# Altium project 2015_FDP.PrjPcb (part 1 of 2)
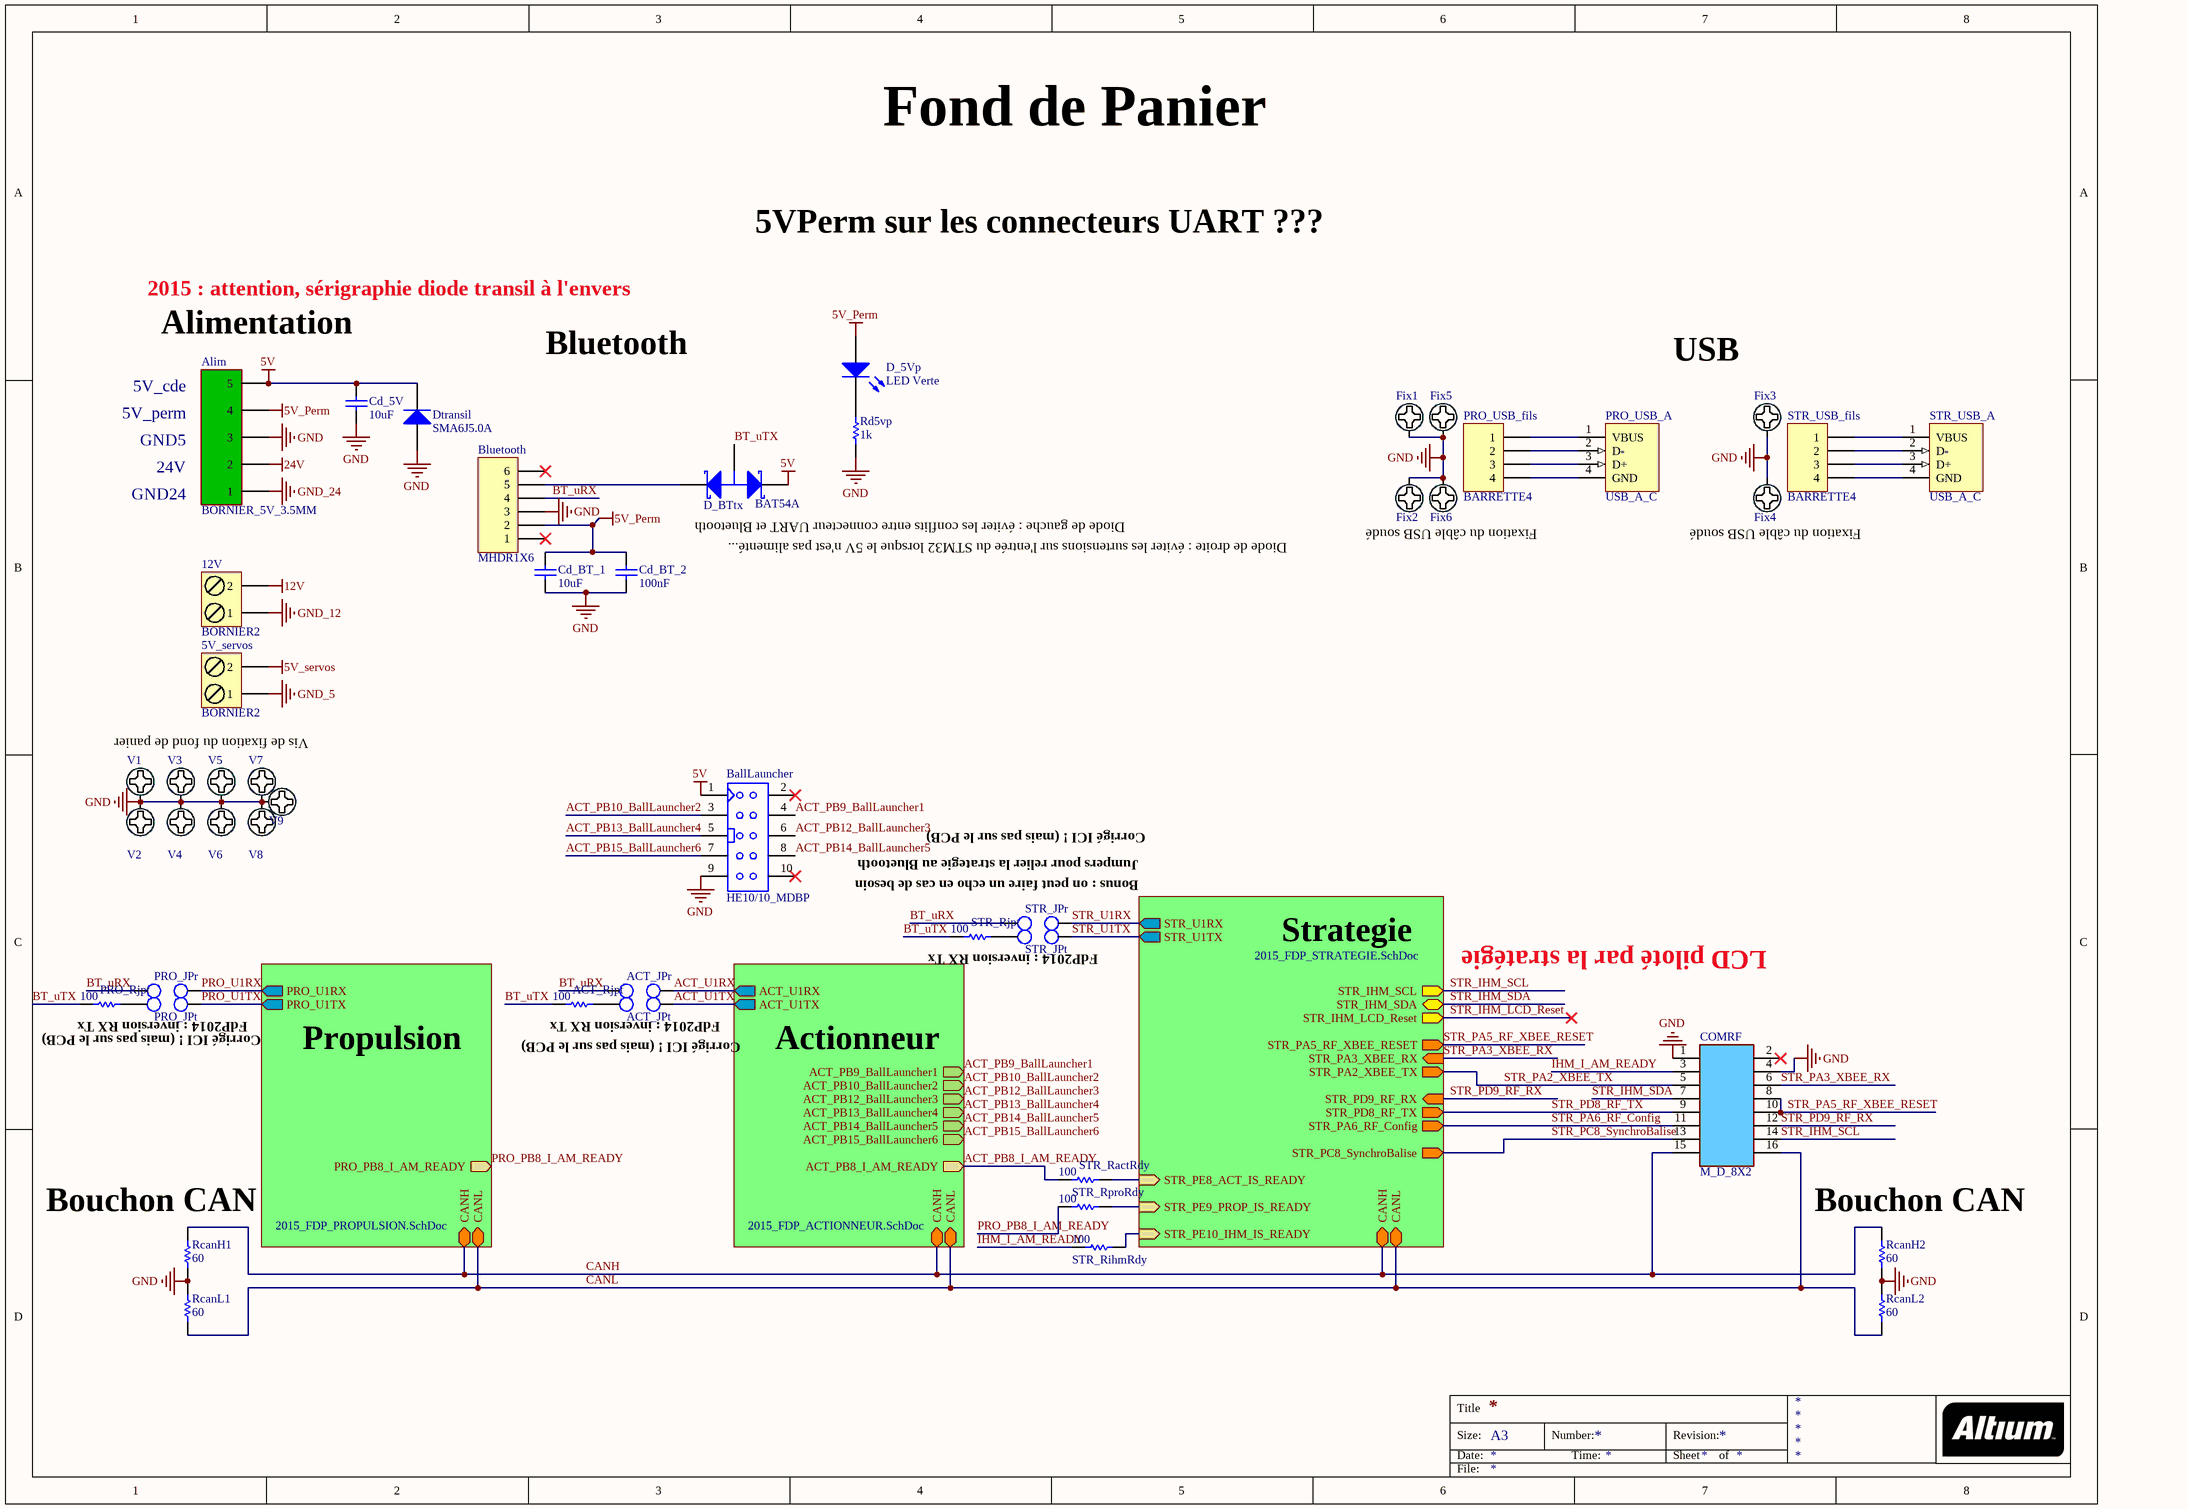
[diagram p0: 2015_FDP_SCHEMA.SchDoc]
4 sheets, 288 parts. Net scope: hierarchical (ports join the sheet entries above them; power ports are global).
Board file: 2015_FDP_PCB.PcbDoc
Sheets:
  2015_FDP_SCHEMA.SchDoc
    Propulsion = 2015_FDP_PROPULSION.SchDoc
    Strategie = 2015_FDP_STRATEGIE.SchDoc
    Actionneur = 2015_FDP_ACTIONNEUR.SchDoc

## Sheet 2015_FDP_SCHEMA.SchDoc
size A3

### Parts
5V_servos  BORNIER2  [BORNIER_2V_5.08MM]
12V  BORNIER2  [BORNIER_2V_5.08MM]
ACT_JPr  JUMPER2  [BARRETTE_2_M_D]  (value not drawn)
ACT_JPt  JUMPER2  [BARRETTE_2_M_D]  (value not drawn)
ACT_Rjpt  100  [R1206_N]
Alim  BORNIER_5V_3.5MM  [BORNIER_5V_3.5MM_femelle_0]
BallLauncher  Type: HE10/10_MDBP  [HE10/10_M_D_BP]  (hidden comment: HE10/10_MALE_DROIT_BAS_PROFIL)
Bluetooth  MHDR1X6  [HE14_6]
Cd_5V  10uF  [C1206_N]
Cd_BT_1  10uF  [C1206_N]
Cd_BT_2  100nF  [C0805_N]
COMRF  Type: M_D_8X2  [HE10/16_M_D_B P]  (hidden comment: BARRETTE_8 CONTACTS_2 RANGEES_MALE_DROITE)
D_5Vp  LED Verte  [LED_0805]
D_BTtx  BAT54A  [SOT23-3N]
Dtransil  SMA6J5.0A  [DO214AC]
Fix1  Pad_M3  [Point Test_D3_P1.6mm]  (value not drawn)
Fix2  Pad_M3  [Point Test_D3_P1.6mm]  (value not drawn)
Fix3  Pad_M3  [Point Test_D3_P1.6mm]  (value not drawn)
Fix4  Pad_M3  [Point Test_D3_P1.6mm]  (value not drawn)
Fix5  Pad_M3  [Point Test_D3_P1.6mm]  (value not drawn)
Fix6  Pad_M3  [Point Test_D3_P1.6mm]  (value not drawn)
PRO_JPr  JUMPER2  [BARRETTE_2_M_D]  (value not drawn)
PRO_JPt  JUMPER2  [BARRETTE_2_M_D]  (value not drawn)
PRO_Rjpt  100  [R1206_N]
PRO_USB_A  USB_A_COUDEE  [USB_A_C]  (value not drawn)
PRO_USB_fils  BARRETTE4  [HE14_4]
RcanH1  60  [R1206_N]
RcanH2  60  [R1206_N]
RcanL1  60  [R1206_N]
RcanL2  60  [R1206_N]
Rd5vp  1k  [R1206_N]
STR_JPr  JUMPER2  [BARRETTE_2_M_D]  (value not drawn)
STR_JPt  JUMPER2  [BARRETTE_2_M_D]  (value not drawn)
STR_RactRdy  100  [R1206_N]
STR_RihmRdy  100  [R1206_N]
STR_Rjpt  100  [R1206_N]
STR_RproRdy  100  [R1206_N]
STR_USB_A  USB_A_COUDEE  [USB_A_C]  (value not drawn)
STR_USB_fils  BARRETTE4  [HE14_4]
V1  Pad_M3  [M3x6mm Torx]  (value not drawn)
V2  Pad_M3  [M3x6mm Torx]  (value not drawn)
V3  Pad_M3  [M3x6mm Torx]  (value not drawn)
V4  Pad_M3  [M3x6mm Torx]  (value not drawn)
V5  Pad_M3  [M3x6mm Torx]  (value not drawn)
V6  Pad_M3  [M3x6mm Torx]  (value not drawn)
V7  Pad_M3  [M3x6mm Torx]  (value not drawn)
V8  Pad_M3  [M3x6mm Torx]  (value not drawn)
V9  Pad_M3  [M3x6mm Torx]  (value not drawn)

### Sub-sheets
Actionneur = 2015_FDP_ACTIONNEUR.SchDoc: CANH (bidir), CANL (bidir), ACT_PB9_BallLauncher1 (out), ACT_PB10_BallLauncher2 (out), ACT_PB12_BallLauncher3 (out), ACT_PB13_BallLauncher4 (out), ACT_PB14_BallLauncher5 (out), ACT_PB15_BallLauncher6 (out), ACT_U1RX (out), ACT_U1TX (out), ACT_PB8_I_AM_READY (out)
Propulsion = 2015_FDP_PROPULSION.SchDoc: CANH (bidir), CANL (bidir), PRO_U1RX (out), PRO_U1TX (out), PRO_PB8_I_AM_READY (out)
Strategie = 2015_FDP_STRATEGIE.SchDoc: STR_IHM_SCL (out), STR_IHM_SDA (bidir), STR_IHM_LCD_Reset (out), STR_PA3_XBEE_RX (in), STR_PA2_XBEE_TX (out), STR_PA5_RF_XBEE_RESET (out), STR_PA6_RF_Config (out), STR_PC8_SynchroBalise (out), STR_PD8_RF_TX (out), STR_PD9_RF_RX (in), CANL (bidir), CANH (bidir), STR_U1RX (out), STR_U1TX (out), STR_PE9_PROP_IS_READY (in), STR_PE8_ACT_IS_READY (in), STR_PE10_IHM_IS_READY (in)

### Nets
5V: Alim.5 BallLauncher.1 Cd_5V.2 D_BTtx.2(K2) Dtransil.2(K)
5V_Perm: Alim.4 Bluetooth.2 Cd_BT_1.2 Cd_BT_2.2 D_5Vp.1(A)
5V_servos: 5V_servos.2
12V: 12V.2
24V: Alim.2
GND: Alim.3 BallLauncher.9 Bluetooth.3 Cd_5V.1 Cd_BT_1.1 Cd_BT_2.1 COMRF.1 COMRF.4 Dtransil.1(A) Fix1.1 Fix2.1 Fix3.1 Fix4.1 Fix5.1 Fix6.1 RcanH1.1 RcanH2.2 RcanL1.2 RcanL2.2 Rd5vp.2 V1.1 V2.1 V3.1 V4.1 V5.1 V6.1 V7.1 V8.1 V9.1
GND_5: 5V_servos.1
GND_12: 12V.1
GND_24: Alim.1
ACT_PB8_I_AM_READY: STR_RactRdy.2 ; sheet Actionneur/ACT_PB8_I_AM_READY
ACT_PB9_BallLauncher1: BallLauncher.4 ; sheet Actionneur/ACT_PB9_BallLauncher1
ACT_PB10_BallLauncher2: BallLauncher.3 ; sheet Actionneur/ACT_PB10_BallLauncher2
ACT_PB12_BallLauncher3: BallLauncher.6 ; sheet Actionneur/ACT_PB12_BallLauncher3
ACT_PB13_BallLauncher4: BallLauncher.5 ; sheet Actionneur/ACT_PB13_BallLauncher4
ACT_PB14_BallLauncher5: BallLauncher.8 ; sheet Actionneur/ACT_PB14_BallLauncher5
ACT_PB15_BallLauncher6: BallLauncher.7 ; sheet Actionneur/ACT_PB15_BallLauncher6
ACT_U1RX: ACT_JPr.2 ; sheet Actionneur/ACT_U1RX
ACT_U1TX: ACT_JPt.2 ; sheet Actionneur/ACT_U1TX
BT_uRX: ACT_JPr.1 Bluetooth.4 PRO_JPr.1 STR_JPr.1
BT_uTX: ACT_Rjpt.2 D_BTtx.3(A) PRO_Rjpt.2 STR_Rjpt.2
CANH: COMRF.15 RcanH1.2 RcanH2.1 ; sheet Propulsion/CANH, sheet Strategie/CANH, sheet Actionneur/CANH
CANL: COMRF.16 RcanL1.1 RcanL2.1 ; sheet Propulsion/CANL, sheet Strategie/CANL, sheet Actionneur/CANL
IHM_I_AM_READY: COMRF.3 STR_RihmRdy.2
PRO_PB8_I_AM_READY: STR_RproRdy.2 ; sheet Propulsion/PRO_PB8_I_AM_READY
PRO_U1RX: PRO_JPr.2 ; sheet Propulsion/PRO_U1RX
PRO_U1TX: PRO_JPt.2 ; sheet Propulsion/PRO_U1TX
STR_IHM_SCL: COMRF.14 ; sheet Strategie/STR_IHM_SCL
STR_IHM_SDA: COMRF.7 ; sheet Strategie/STR_IHM_SDA
STR_PA2_XBEE_TX: COMRF.5 ; sheet Strategie/STR_PA2_XBEE_TX
STR_PA3_XBEE_RX: COMRF.6 ; sheet Strategie/STR_PA3_XBEE_RX
STR_PA5_RF_XBEE_RESET: COMRF.8 COMRF.10 ; sheet Strategie/STR_PA5_RF_XBEE_RESET
STR_PA6_RF_Config: COMRF.11 ; sheet Strategie/STR_PA6_RF_Config
STR_PC8_SynchroBalise: COMRF.13 ; sheet Strategie/STR_PC8_SynchroBalise
STR_PD8_RF_TX: COMRF.9 ; sheet Strategie/STR_PD8_RF_TX
STR_PD9_RF_RX: COMRF.12 ; sheet Strategie/STR_PD9_RF_RX
STR_PE8_ACT_IS_READY: STR_RactRdy.1 ; sheet Strategie/STR_PE8_ACT_IS_READY
STR_PE9_PROP_IS_READY: STR_RproRdy.1 ; sheet Strategie/STR_PE9_PROP_IS_READY
STR_PE10_PROP_IS_READY: STR_RihmRdy.1 ; sheet Strategie/STR_PE10_IHM_IS_READY
STR_U1RX: STR_JPr.2 ; sheet Strategie/STR_U1RX
STR_U1TX: STR_JPt.2 ; sheet Strategie/STR_U1TX
NetACT_JPt_1: ACT_JPt.1 ACT_Rjpt.1
NetBluetooth_5: Bluetooth.5 D_BTtx.1(K1)
NetD_5Vp_2: D_5Vp.2(K) Rd5vp.1
NetPRO_JPt_1: PRO_JPt.1 PRO_Rjpt.1
NetPRO_USB_A_1: PRO_USB_A.1(VBUS) PRO_USB_fils.1
NetPRO_USB_A_2: PRO_USB_A.2(D-) PRO_USB_fils.2
NetPRO_USB_A_3: PRO_USB_A.3(D+) PRO_USB_fils.3
NetPRO_USB_A_4: PRO_USB_A.4(GND) PRO_USB_fils.4
NetSTR_JPt_1: STR_JPt.1 STR_Rjpt.1
NetSTR_USB_A_1: STR_USB_A.1(VBUS) STR_USB_fils.1
NetSTR_USB_A_2: STR_USB_A.2(D-) STR_USB_fils.2
NetSTR_USB_A_3: STR_USB_A.3(D+) STR_USB_fils.3
NetSTR_USB_A_4: STR_USB_A.4(GND) STR_USB_fils.4

Not connected (* = marked no-connect by the designer): BallLauncher 2* 10*; Bluetooth 1* 6*; COMRF 2*

### Notes on the sheet
- Fond de Panier
- 5VPerm sur les connecteurs UART ???
- 2015 : attention, sérigraphie diode transil à l'envers
- Alimentation
- Bluetooth
- USB
- 5V_perm
- 5V_cde
- GND5
- 24V
- GND24
- Diode de gauche : éviter les conflits entre connecteur UART et Bluetooth
- (near Cd_BT_2) Diode de droite : éviter les surtensions sur l'entrée du STM32 lorsque le 5V n'est pas alimenté...
- Fixation du câble USB soudé
- Vis de fixation du fond de panier
- Jumpers pour relier la strategie au Bluetooth
- Corrigé ICI ! (mais pas sur le PCB)
- Bonus : on peut faire un echo en cas de besoin
- FdP2014 : inversion RX Tx
- LCD piloté par la stratégie
- (near RcanH1) Bouchon CAN
- (near RcanH2) Bouchon CAN
- Title
- Size:
- Date:
- A3
- Number:
- Time:
- Revision:
- Sheet
- of
- File:

### Library data of the parts
5V_servos 12V = BORNIER2: Terminal blocks, 2 pins, pitch=5mm
ACT_JPr ACT_JPt PRO_JPr PRO_JPt STR_JPr STR_JPt = JUMPER2: BARRETTE 2 CONTACTS 1 RANGEE MALE DROITE; Type: JUMPER2
ACT_Rjpt PRO_Rjpt RcanH1 RcanH2 RcanL1 RcanL2 Rd5vp STR_RactRdy STR_RihmRdy STR_Rjpt STR_RproRdy = Resistor: Published: 8-Jun-2000; LatestRevisionDate: 17-Jul-2002; LatestRevisionNote: Re-released for DXP Platform.; PackageReference: AXIAL-0.5; Publisher: Altium Limited
BallLauncher = HE10/10_MALE_DROIT_BAS_PROFIL: EMBASE HE10/10 MALE DROIT BAS PROFIL
Bluetooth = MHDR1X6: Header, 6-Pin; LatestRevisionDate: 17-Jul-2002; LatestRevisionNote: Re-released for DXP Platform.; Publisher: Altium Limited
Cd_5V Cd_BT_1 Cd_BT_2 = Condensateur: Capacitor; Published: 8-Jun-2000; LatestRevisionDate: 17-Jul-2002; LatestRevisionNote: Re-released for DXP Platform.; PackageReference: RAD-0.3; Publisher: Altium Limited
D_5Vp = LED: Typical LED; Published: 8-Jun-2000; LatestRevisionDate: 08-Jul-2005; LatestRevisionNote: Mech Layer 1 removed.; PackageReference: LED-1; Publisher: Altium Limited
D_BTtx = Diode Shottky double  BAT54A: DIODE SCHOTTKY DOUBLE; Manufacturer: ZETEX; ComponentLink1URL: http://www.farnell.com/datasheets/27632.pdf; ComponentLink1Description: http://www.farnell.com/datasheets/27632.pdf; Supplier Part Number: 9526498; Supplier: Farnell; RoHS: YES; Manufacturer Part Number: BAT54A
Dtransil = Diode 1N4001: 1 Amp General Purpose Rectifier; Published: 8-Jun-2000; LatestRevisionDate: 17-Jul-2002; LatestRevisionNote: Re-released for DXP Platform.; DatasheetVersion: 1998; PackageVersion: Aug-1999; PackageReference: DO-41; Publisher: Altium Limited; Code_JEDEC: DO-204-AL; ComponentLink1Description: Manufacturer Link; ComponentLink1URL: http://www.fairchildsemi.com/; ComponentLink2Description: Datasheet; ComponentLink2URL: http://www.fairchildsemi.com/ds/1N%2F1N4001.pdf
Fix1-Fix6 V1-V9 = Vis M3 X 6mm _TORX_Tête 6mm: Publisher: Damien Guitton
PRO_USB_A STR_USB_A = USB_A_COUDEE: EMBASE USB TRAVERSANTE TYPE A COUDEE; Type: USB_A_C
PRO_USB_fils STR_USB_fils = BARRETTE4: Header, 4-Pin; LatestRevisionDate: 17-Jul-2002; LatestRevisionNote: Re-released for DXP Platform.; Publisher: Altium Limited

## Sheet 2015_FDP_PROPULSION.SchDoc
size A2
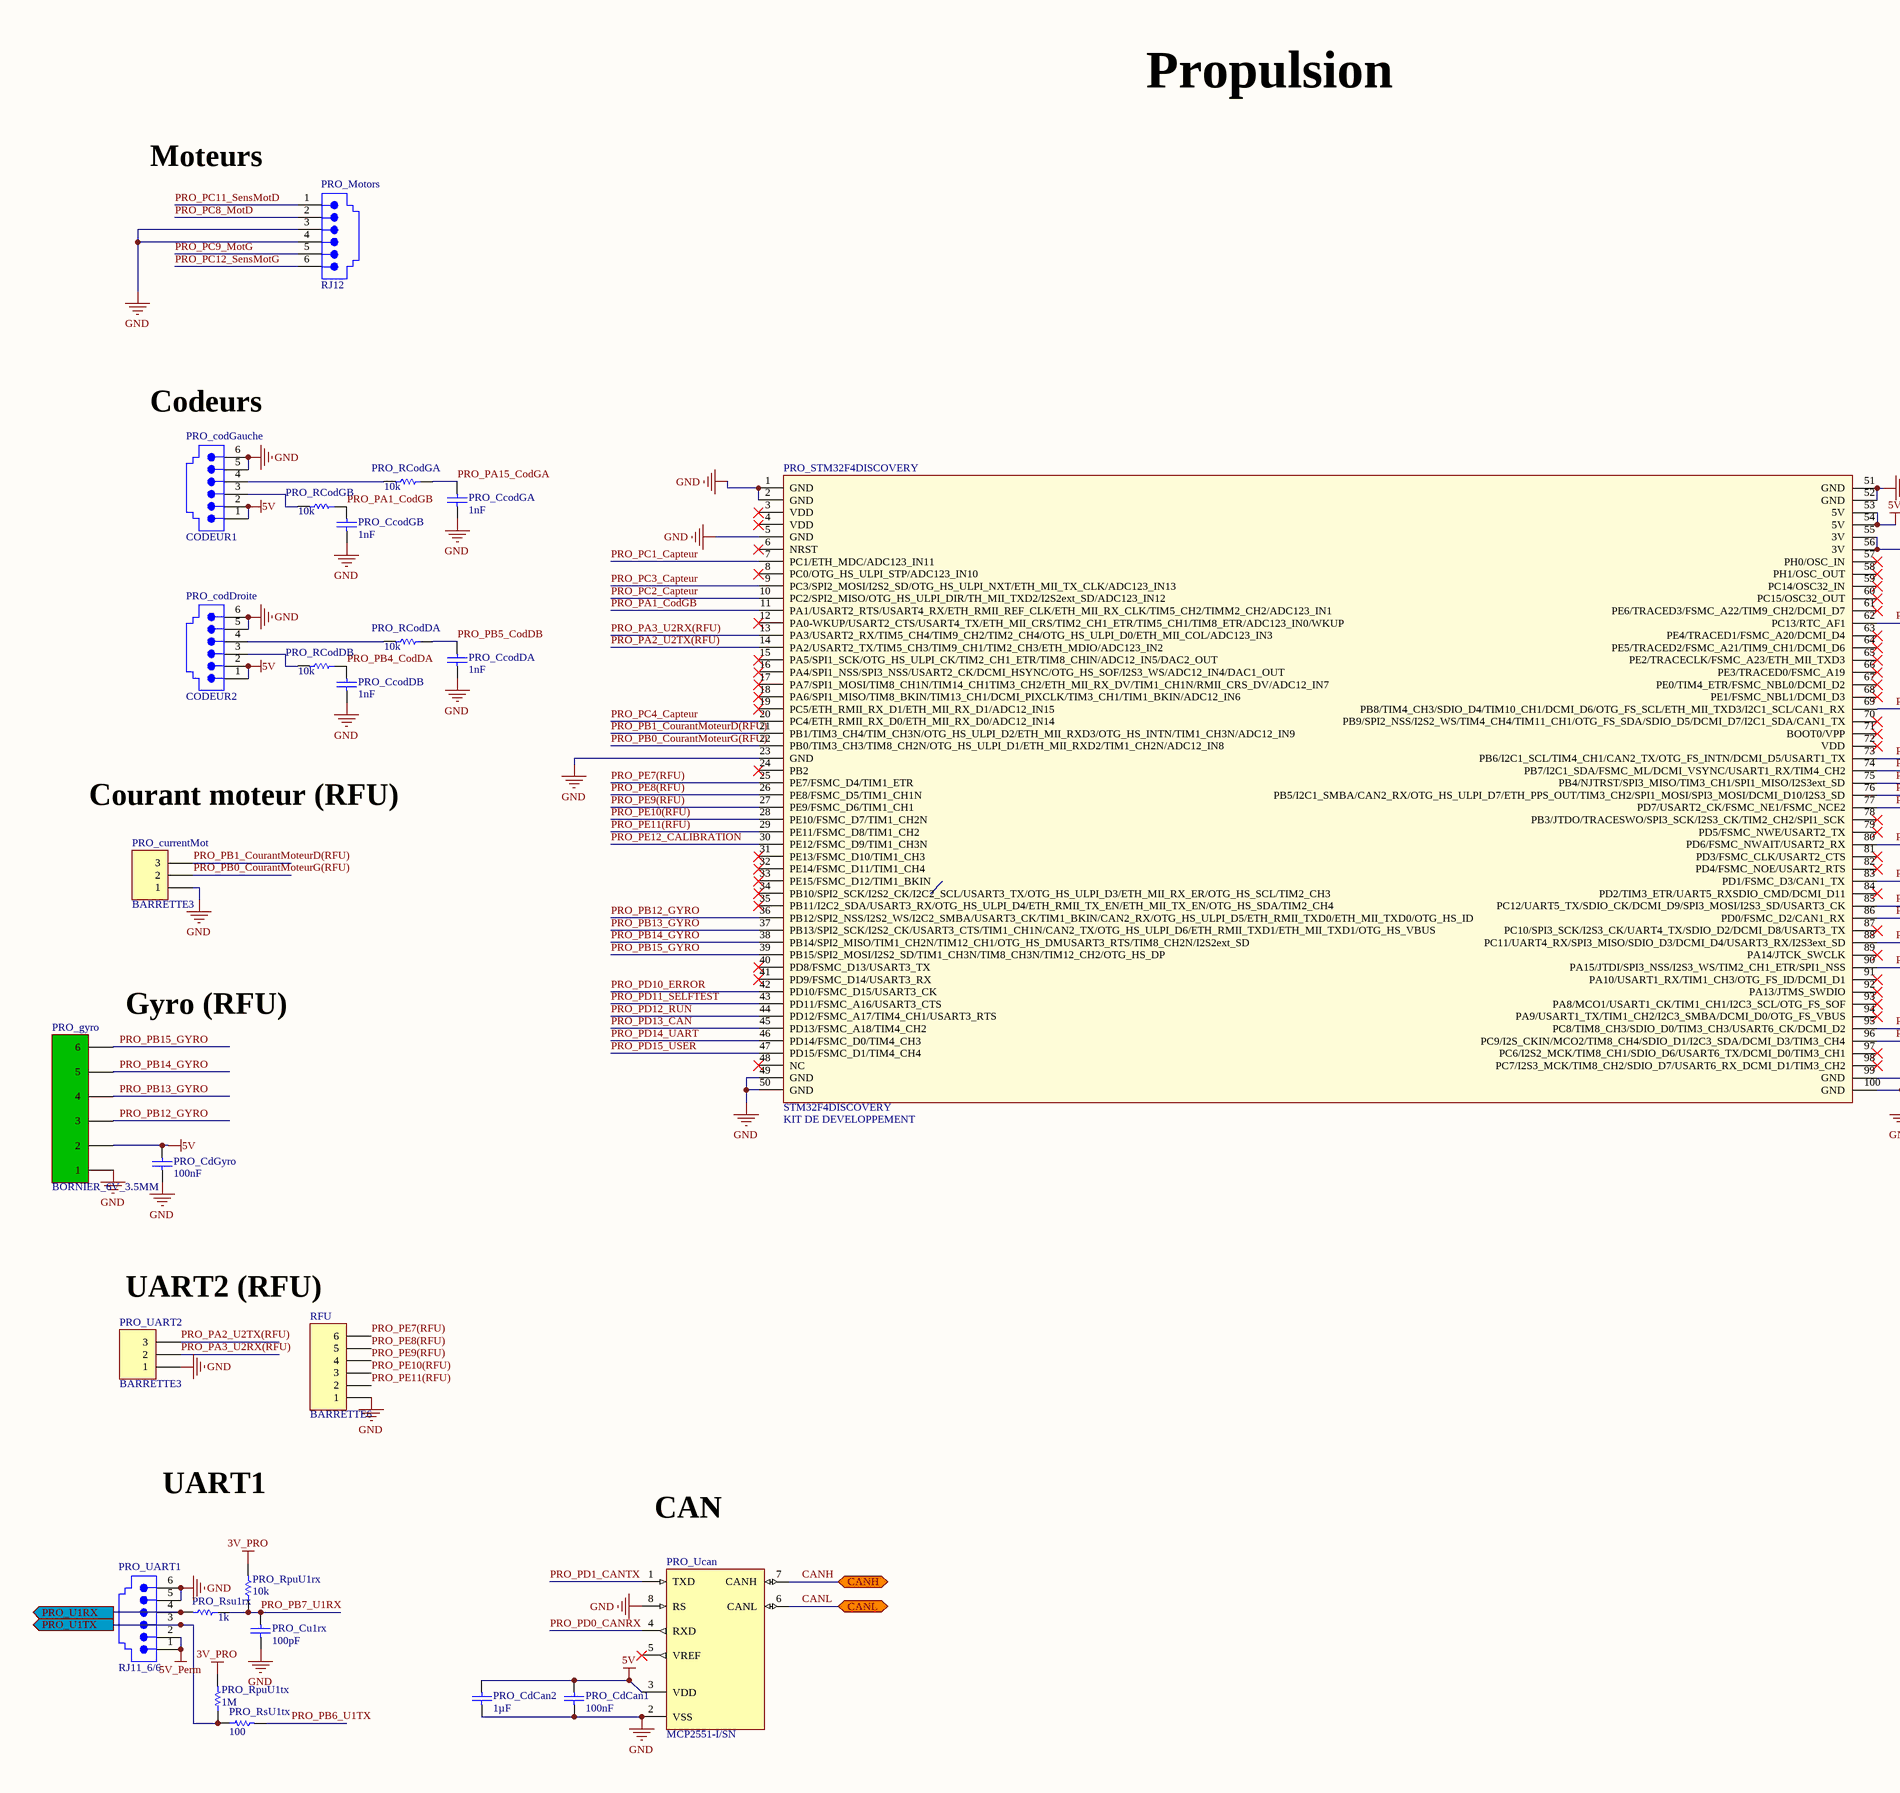
[diagram p1: 2015_FDP_PROPULSION.SchDoc, left]
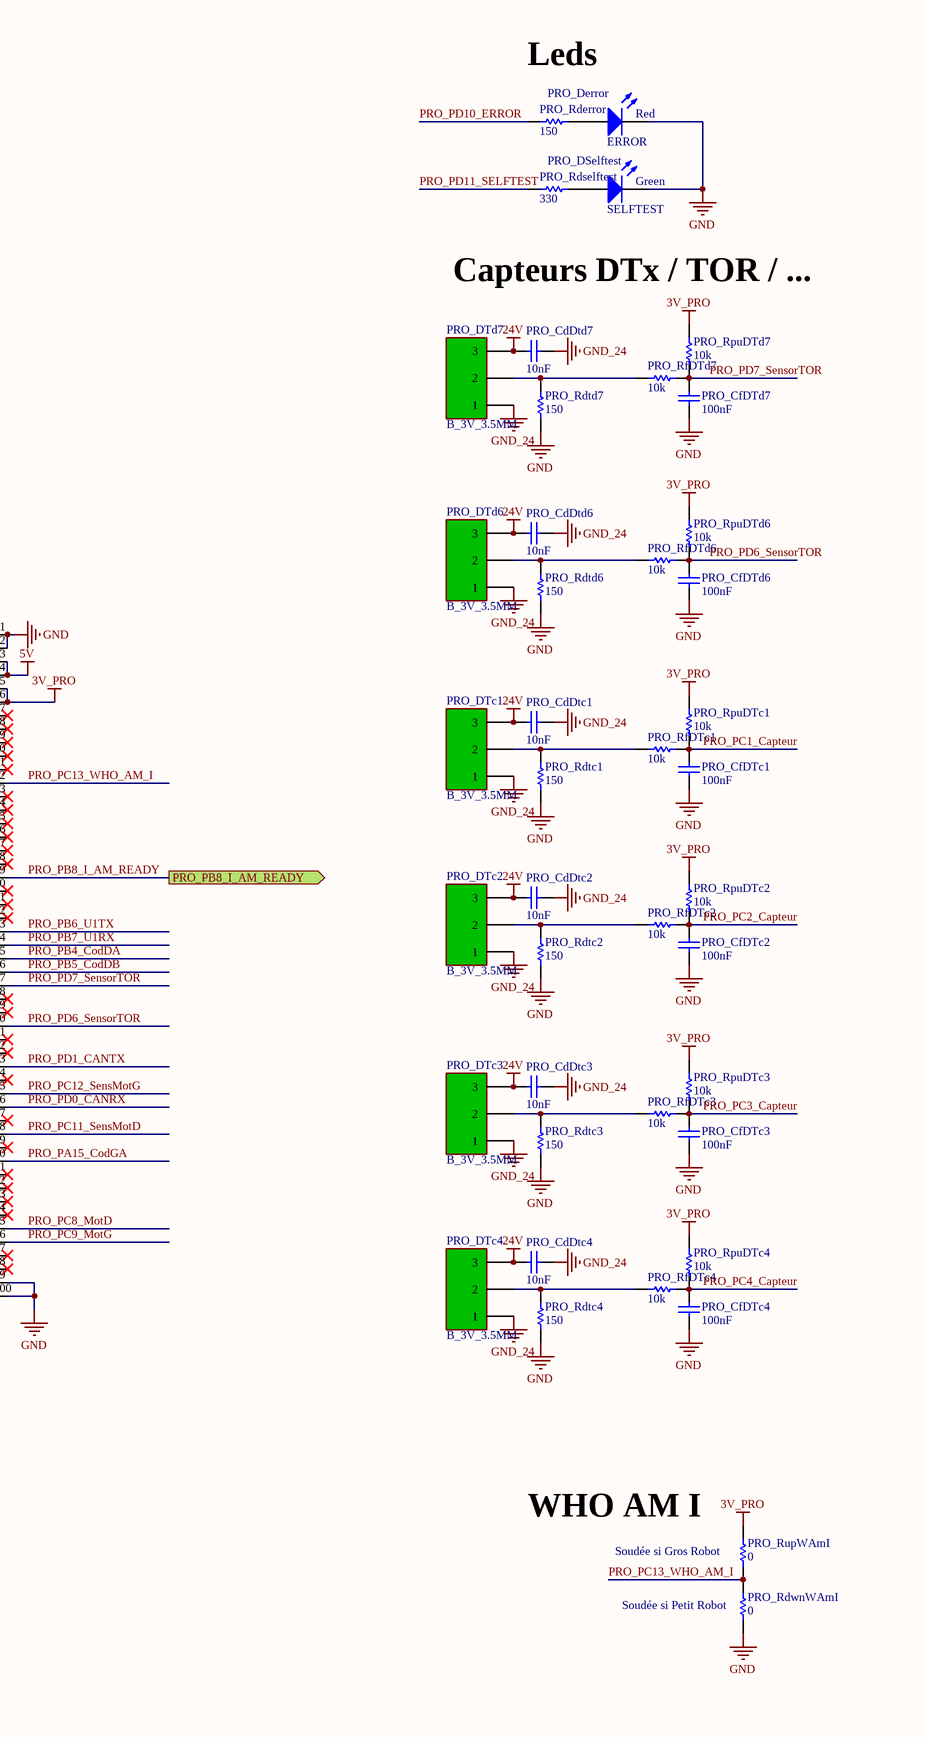
[diagram p2: 2015_FDP_PROPULSION.SchDoc, right]

### Parts
PRO_CcodDA  1nF  [C0805_N]
PRO_CcodDB  1nF  [C0805_N]
PRO_CcodGA  1nF  [C0805_N]
PRO_CcodGB  1nF  [C0805_N]
PRO_CdCan1  100nF  [C0805_N]
PRO_CdCan2  1µF  [C0805_N]
PRO_CdDtc1  10nF  [C0805_N]
PRO_CdDtc2  10nF  [C0805_N]
PRO_CdDtc3  10nF  [C0805_N]
PRO_CdDtc4  10nF  [C0805_N]
PRO_CdDtd6  10nF  [C0805_N]
PRO_CdDtd7  10nF  [C0805_N]
PRO_CdGyro  100nF  [C0805_N]
PRO_CfDTc1  100nF  [C0805_N]
PRO_CfDTc2  100nF  [C0805_N]
PRO_CfDTc3  100nF  [C0805_N]
PRO_CfDTc4  100nF  [C0805_N]
PRO_CfDTd6  100nF  [C0805_N]
PRO_CfDTd7  100nF  [C0805_N]
PRO_codDroite  CODEUR2  [RJ11_6/6 - droit]
PRO_codGauche  CODEUR1  [RJ11_6/6 - droit]
PRO_Cu1rx  100pF  [C0805_N]
PRO_currentMot  BARRETTE3  [HE14_3]
PRO_Derror  ERROR  [LED_0805]
PRO_DSelftest  SELFTEST  [LED_0805]
PRO_DTc1  B_3V_3.5MM  [BORNIER_3V_3.5MM]
PRO_DTc2  B_3V_3.5MM  [BORNIER_3V_3.5MM]
PRO_DTc3  B_3V_3.5MM  [BORNIER_3V_3.5MM]
PRO_DTc4  B_3V_3.5MM  [BORNIER_3V_3.5MM]
PRO_DTd6  B_3V_3.5MM  [BORNIER_3V_3.5MM]
PRO_DTd7  B_3V_3.5MM  [BORNIER_3V_3.5MM]
PRO_gyro  BORNIER_6V_3.5MM  [BORNIER_6V_3.5MM]
PRO_Motors  RJ12  [RJ11_6/6 - droit]
PRO_RCodDA  10k  [R1206_N]
PRO_RCodDB  10k  [R1206_N]
PRO_RCodGA  10k  [R1206_N]
PRO_RCodGB  10k  [R1206_N]
PRO_Rderror  150  [R1206_N]
PRO_Rdselftest  330  [R1206_N]
PRO_Rdtc1  150  [R1206_N]
PRO_Rdtc2  150  [R1206_N]
PRO_Rdtc3  150  [R1206_N]
PRO_Rdtc4  150  [R1206_N]
PRO_Rdtd6  150  [R1206_N]
PRO_Rdtd7  150  [R1206_N]
PRO_RdwnWAmI  0  [R1206_N]
PRO_RfDTc1  10k  [R1206_N]
PRO_RfDTc2  10k  [R1206_N]
PRO_RfDTc3  10k  [R1206_N]
PRO_RfDTc4  10k  [R1206_N]
PRO_RfDTd6  10k  [R1206_N]
PRO_RfDTd7  10k  [R1206_N]
PRO_RpuDTc1  10k  [R1206_N]
PRO_RpuDTc2  10k  [R1206_N]
PRO_RpuDTc3  10k  [R1206_N]
PRO_RpuDTc4  10k  [R1206_N]
PRO_RpuDTd6  10k  [R1206_N]
PRO_RpuDTd7  10k  [R1206_N]
PRO_RpuU1rx  10k  [R1206_N]
PRO_RpuU1tx  1M  [R1206_N]
PRO_Rsu1rx  1k  [R1206_N]
PRO_RsU1tx  100  [R1206_N]
PRO_RupWAmI  0  [R1206_N]
PRO_STM32F4DISCOVERY  STM32F4DISCOVERY  Type: KIT DE DEVELOPPEMENT  [STM32_F4DISCOVERY]
PRO_UART1  RJ11_6/6  [RJ11_6/6 - droit]
PRO_UART2  BARRETTE3  [HE14_3]
PRO_Ucan  MCP2551-I/SN  [SO8_N]
RFU  BARRETTE6  [HE14_6]

### Ports
CANH (bidir), CANL (bidir), PRO_PB8_I_AM_READY (out), PRO_U1RX (out), PRO_U1TX (out)

### Nets
3V_PRO: PRO_RpuDTc1.2 PRO_RpuDTc2.2 PRO_RpuDTc3.2 PRO_RpuDTc4.2 PRO_RpuDTd6.2 PRO_RpuDTd7.2 PRO_RpuU1rx.2 PRO_RpuU1tx.2 PRO_RupWAmI.2 PRO_STM32F4DISCOVERY.55(3V) PRO_STM32F4DISCOVERY.56(3V)
5V: PRO_CdCan1.2 PRO_CdCan2.2 PRO_CdGyro.2 PRO_codDroite.1 PRO_codDroite.2 PRO_codGauche.1 PRO_codGauche.2 PRO_gyro.2 PRO_STM32F4DISCOVERY.53(5V) PRO_STM32F4DISCOVERY.54(5V) PRO_Ucan.3(VDD)
5V_Perm: PRO_UART1.1 PRO_UART1.2
24V: PRO_CdDtc1.2 PRO_CdDtc2.2 PRO_CdDtc3.2 PRO_CdDtc4.2 PRO_CdDtd6.2 PRO_CdDtd7.2 PRO_DTc1.3 PRO_DTc2.3 PRO_DTc3.3 PRO_DTc4.3 PRO_DTd6.3 PRO_DTd7.3
GND: PRO_CcodDA.1 PRO_CcodDB.1 PRO_CcodGA.1 PRO_CcodGB.1 PRO_CdCan1.1 PRO_CdCan2.1 PRO_CdGyro.1 PRO_CfDTc1.1 PRO_CfDTc2.1 PRO_CfDTc3.1 PRO_CfDTc4.1 PRO_CfDTd6.1 PRO_CfDTd7.1 PRO_codDroite.5 PRO_codDroite.6 PRO_codGauche.5 PRO_codGauche.6 PRO_Cu1rx.1 PRO_currentMot.1 PRO_Derror.2(K) PRO_DSelftest.2(K) PRO_gyro.1 PRO_Motors.3 PRO_Motors.4 PRO_Rdtc1.1 PRO_Rdtc2.1 PRO_Rdtc3.1 PRO_Rdtc4.1 PRO_Rdtd6.1 PRO_Rdtd7.1 PRO_RdwnWAmI.1 PRO_STM32F4DISCOVERY.1(GND) PRO_STM32F4DISCOVERY.2(GND) PRO_STM32F4DISCOVERY.5(GND) PRO_STM32F4DISCOVERY.23(GND) PRO_STM32F4DISCOVERY.49(GND) PRO_STM32F4DISCOVERY.50(GND) PRO_STM32F4DISCOVERY.51(GND) PRO_STM32F4DISCOVERY.52(GND) PRO_STM32F4DISCOVERY.99(GND) PRO_STM32F4DISCOVERY.100(GND) PRO_UART1.5 PRO_UART1.6 PRO_UART2.1 PRO_Ucan.2(VSS) PRO_Ucan.8(RS) RFU.1
GND_24: PRO_CdDtc1.1 PRO_CdDtc2.1 PRO_CdDtc3.1 PRO_CdDtc4.1 PRO_CdDtd6.1 PRO_CdDtd7.1 PRO_DTc1.1 PRO_DTc2.1 PRO_DTc3.1 PRO_DTc4.1 PRO_DTd6.1 PRO_DTd7.1
CANH: PRO_Ucan.7(CANH) ; port CANH
CANL: PRO_Ucan.6(CANL) ; port CANL
PRO_PA1_CodGB: PRO_CcodGB.2 PRO_RCodGB.1 PRO_STM32F4DISCOVERY.11(PA1/USART2_RTS/USART4_RX/ETH_RMII_REF_CLK/ETH_MII_RX_CLK/TIM5_CH2/TIMM2_CH2/ADC123_IN1)
PRO_PA2_U2TX(RFU): PRO_STM32F4DISCOVERY.14(PA2/USART2_TX/TIM5_CH3/TIM9_CH1/TIM2_CH3/ETH_MDIO/ADC123_IN2) PRO_UART2.3
PRO_PA3_U2RX(RFU): PRO_STM32F4DISCOVERY.13(PA3/USART2_RX/TIM5_CH4/TIM9_CH2/TIM2_CH4/OTG_HS_ULPI_D0/ETH_MII_COL/ADC123_IN3) PRO_UART2.2
PRO_PA15_CodGA: PRO_CcodGA.2 PRO_RCodGA.1 PRO_STM32F4DISCOVERY.90(PA15/JTDI/SPI3_NSS/I2S3_WS/TIM2_CH1_ETR/SPI1_NSS)
PRO_PB0_CourantMoteurG(RFU): PRO_currentMot.2 PRO_STM32F4DISCOVERY.22(PB0/TIM3_CH3/TIM8_CH2N/OTG_HS_ULPI_D1/ETH_MII_RXD2/TIM1_CH2N/ADC12_IN8)
PRO_PB1_CourantMoteurD(RFU): PRO_currentMot.3 PRO_STM32F4DISCOVERY.21(PB1/TIM3_CH4/TIM_CH3N/OTG_HS_ULPI_D2/ETH_MII_RXD3/OTG_HS_INTN/TIM1_CH3N/ADC12_IN9)
PRO_PB4_CodDA: PRO_CcodDB.2 PRO_RCodDB.1 PRO_STM32F4DISCOVERY.75(PB4/NJTRST/SPI3_MISO/TIM3_CH1/SPI1_MISO/I2S3ext_SD)
PRO_PB5_CodDB: PRO_CcodDA.2 PRO_RCodDA.1 PRO_STM32F4DISCOVERY.76(PB5/I2C1_SMBA/CAN2_RX/OTG_HS_ULPI_D7/ETH_PPS_OUT/TIM3_CH2/SPI1_MOSI/SPI3_MOSI/DCMI_D10/I2S3_SD)
PRO_PB6_U1TX: PRO_RsU1tx.2 PRO_STM32F4DISCOVERY.73(PB6/I2C1_SCL/TIM4_CH1/CAN2_TX/OTG_FS_INTN/DCMI_D5/USART1_TX)
PRO_PB7_U1RX: PRO_Cu1rx.2 PRO_RpuU1rx.1 PRO_Rsu1rx.1 PRO_STM32F4DISCOVERY.74(PB7/I2C1_SDA/FSMC_ML/DCMI_VSYNC/USART1_RX/TIM4_CH2)
PRO_PB8_I_AM_READY: PRO_STM32F4DISCOVERY.69(PB8/TIM4_CH3/SDIO_D4/TIM10_CH1/DCMI_D6/OTG_FS_SCL/ETH_MII_TXD3/I2C1_SCL/CAN1_RX) ; port PRO_PB8_I_AM_READY
PRO_PB12_GYRO: PRO_gyro.3 PRO_STM32F4DISCOVERY.36(PB12/SPI2_NSS/I2S2_WS/I2C2_SMBA/USART3_CK/TIM1_BKIN/CAN2_RX/OTG_HS_ULPI_D5/ETH_RMII_TXD0/ETH_MII_TXD0/OTG_HS_ID)
PRO_PB13_GYRO: PRO_gyro.4 PRO_STM32F4DISCOVERY.37(PB13/SPI2_SCK/I2S2_CK/USART3_CTS/TIM1_CH1N/CAN2_TX/OTG_HS_ULPI_D6/ETH_RMII_TXD1/ETH_MII_TXD1/OTG_HS_VBUS)
PRO_PB14_GYRO: PRO_gyro.5 PRO_STM32F4DISCOVERY.38(PB14/SPI2_MISO/TIM1_CH2N/TIM12_CH1/OTG_HS_DMUSART3_RTS/TIM8_CH2N/I2S2ext_SD)
PRO_PB15_GYRO: PRO_gyro.6 PRO_STM32F4DISCOVERY.39(PB15/SPI2_MOSI/I2S2_SD/TIM1_CH3N/TIM8_CH3N/TIM12_CH2/OTG_HS_DP)
PRO_PC1_Capteur: PRO_CfDTc1.2 PRO_RfDTc1.2 PRO_RpuDTc1.1 PRO_STM32F4DISCOVERY.7(PC1/ETH_MDC/ADC123_IN11)
PRO_PC2_Capteur: PRO_CfDTc2.2 PRO_RfDTc2.2 PRO_RpuDTc2.1 PRO_STM32F4DISCOVERY.10(PC2/SPI2_MISO/OTG_HS_ULPI_DIR/TH_MII_TXD2/I2S2ext_SD/ADC123_IN12)
PRO_PC3_Capteur: PRO_CfDTc3.2 PRO_RfDTc3.2 PRO_RpuDTc3.1 PRO_STM32F4DISCOVERY.9(PC3/SPI2_MOSI/I2S2_SD/OTG_HS_ULPI_NXT/ETH_MII_TX_CLK/ADC123_IN13)
PRO_PC4_Capteur: PRO_CfDTc4.2 PRO_RfDTc4.2 PRO_RpuDTc4.1 PRO_STM32F4DISCOVERY.20(PC4/ETH_RMII_RX_D0/ETH_MII_RX_D0/ADC12_IN14)
PRO_PC8_MotD: PRO_Motors.2 PRO_STM32F4DISCOVERY.95(PC8/TIM8_CH3/SDIO_D0/TIM3_CH3/USART6_CK/DCMI_D2)
PRO_PC9_MotG: PRO_Motors.5 PRO_STM32F4DISCOVERY.96(PC9/I2S_CKIN/MCO2/TIM8_CH4/SDIO_D1/I2C3_SDA/DCMI_D3/TIM3_CH4)
PRO_PC11_SensMotD: PRO_Motors.1 PRO_STM32F4DISCOVERY.88(PC11/UART4_RX/SPI3_MISO/SDIO_D3/DCMI_D4/USART3_RX/I2S3ext_SD)
PRO_PC12_SensMotG: PRO_Motors.6 PRO_STM32F4DISCOVERY.85(PC12/UART5_TX/SDIO_CK/DCMI_D9/SPI3_MOSI/I2S3_SD/USART3_CK)
PRO_PC13_WHO_AM_I: PRO_RdwnWAmI.2 PRO_RupWAmI.1 PRO_STM32F4DISCOVERY.62(PC13/RTC_AF1)
PRO_PD0_CANRX: PRO_STM32F4DISCOVERY.86(PD0/FSMC_D2/CAN1_RX) PRO_Ucan.4(RXD)
PRO_PD1_CANTX: PRO_STM32F4DISCOVERY.83(PD1/FSMC_D3/CAN1_TX) PRO_Ucan.1(TXD)
PRO_PD6_SensorTOR: PRO_CfDTd6.2 PRO_RfDTd6.2 PRO_RpuDTd6.1 PRO_STM32F4DISCOVERY.80(PD6/FSMC_NWAIT/USART2_RX)
PRO_PD7_SensorTOR: PRO_CfDTd7.2 PRO_RfDTd7.2 PRO_RpuDTd7.1 PRO_STM32F4DISCOVERY.77(PD7/USART2_CK/FSMC_NE1/FSMC_NCE2)
PRO_PD10_ERROR: PRO_Rderror.1 PRO_STM32F4DISCOVERY.42(PD10/FSMC_D15/USART3_CK)
PRO_PD11_SELFTEST: PRO_Rdselftest.1 PRO_STM32F4DISCOVERY.43(PD11/FSMC_A16/USART3_CTS)
PRO_PD12_RUN: PRO_STM32F4DISCOVERY.44(PD12/FSMC_A17/TIM4_CH1/USART3_RTS)
PRO_PD13_CAN: PRO_STM32F4DISCOVERY.45(PD13/FSMC_A18/TIM4_CH2)
PRO_PD14_UART: PRO_STM32F4DISCOVERY.46(PD14/FSMC_D0/TIM4_CH3)
PRO_PD15_USER: PRO_STM32F4DISCOVERY.47(PD15/FSMC_D1/TIM4_CH4)
PRO_PE7(RFU): PRO_STM32F4DISCOVERY.25(PE7/FSMC_D4/TIM1_ETR) RFU.6
PRO_PE8(RFU): PRO_STM32F4DISCOVERY.26(PE8/FSMC_D5/TIM1_CH1N) RFU.5
PRO_PE9(RFU): PRO_STM32F4DISCOVERY.27(PE9/FSMC_D6/TIM1_CH1) RFU.4
PRO_PE10(RFU): PRO_STM32F4DISCOVERY.28(PE10/FSMC_D7/TIM1_CH2N) RFU.3
PRO_PE11(RFU): PRO_STM32F4DISCOVERY.29(PE11/FSMC_D8/TIM1_CH2) RFU.2
PRO_PE12_CALIBRATION: PRO_STM32F4DISCOVERY.30(PE12/FSMC_D9/TIM1_CH3N)
PRO_U1RX: PRO_Rsu1rx.2 PRO_UART1.4 ; port PRO_U1RX
PRO_U1TX: PRO_RpuU1tx.1 PRO_RsU1tx.1 PRO_UART1.3 ; port PRO_U1TX
NetPRO_codDroite_3: PRO_codDroite.3 PRO_RCodDB.2
NetPRO_codDroite_4: PRO_codDroite.4 PRO_RCodDA.2
NetPRO_codGauche_3: PRO_codGauche.3 PRO_RCodGB.2
NetPRO_codGauche_4: PRO_codGauche.4 PRO_RCodGA.2
NetPRO_Derror_1: PRO_Derror.1(A) PRO_Rderror.2
NetPRO_DSelftest_1: PRO_DSelftest.1(A) PRO_Rdselftest.2
NetPRO_DTc1_2: PRO_DTc1.2 PRO_Rdtc1.2 PRO_RfDTc1.1
NetPRO_DTc2_2: PRO_DTc2.2 PRO_Rdtc2.2 PRO_RfDTc2.1
NetPRO_DTc3_2: PRO_DTc3.2 PRO_Rdtc3.2 PRO_RfDTc3.1
NetPRO_DTc4_2: PRO_DTc4.2 PRO_Rdtc4.2 PRO_RfDTc4.1
NetPRO_DTd6_2: PRO_DTd6.2 PRO_Rdtd6.2 PRO_RfDTd6.1
NetPRO_DTd7_2: PRO_DTd7.2 PRO_Rdtd7.2 PRO_RfDTd7.1

Not connected (* = marked no-connect by the designer): PRO_STM32F4DISCOVERY 3(VDD)* 4(VDD)* 6(NRST)* 8(PC0/OTG_HS_ULPI_STP/ADC123_IN10)* 12(PA0-WKUP/USART2_CTS/USART4_TX/ETH_MII_CRS/TIM2_CH1_ETR/TIM5_CH1/TIM8_ETR/ADC123_IN0/WKUP)* 15(PA5/SPI1_SCK/OTG_HS_ULPI_CK/TIM2_CH1_ETR/TIM8_CHIN/ADC12_IN5/DAC2_OUT)* 16(PA4/SPI1_NSS/SPI3_NSS/USART2_CK/DCMI_HSYNC/OTG_HS_SOF/I2S3_WS/ADC12_IN4/DAC1_OUT)* 17(PA7/SPI1_MOSI/TIM8_CH1N/TIM14_CH1TIM3_CH2/ETH_MII_RX_DV/TIM1_CH1N/RMII_CRS_DV/ADC12_IN7)* 18(PA6/SPI1_MISO/TIM8_BKIN/TIM13_CH1/DCMI_PIXCLK/TIM3_CH1/TIM1_BKIN/ADC12_IN6)* 19(PC5/ETH_RMII_RX_D1/ETH_MII_RX_D1/ADC12_IN15)* 24(PB2)* 31(PE13/FSMC_D10/TIM1_CH3)* 32(PE14/FSMC_D11/TIM1_CH4)* 33(PE15/FSMC_D12/TIM1_BKIN)* 34(PB10/SPI2_SCK/I2S2_CK/I2C2_SCL/USART3_TX/OTG_HS_ULPI_D3/ETH_MII_RX_ER/OTG_HS_SCL/TIM2_CH3)* 35(PB11/I2C2_SDA/USART3_RX/OTG_HS_ULPI_D4/ETH_RMII_TX_EN/ETH_MII_TX_EN/OTG_HS_SDA/TIM2_CH4)* 40(PD8/FSMC_D13/USART3_TX)* 41(PD9/FSMC_D14/USART3_RX)* 48(NC)* 57(PH0/OSC_IN)* 58(PH1/OSC_OUT)* 59(PC14/OSC32_IN)* 60(PC15/OSC32_OUT)* 61(PE6/TRACED3/FSMC_A22/TIM9_CH2/DCMI_D7)* 63(PE4/TRACED1/FSMC_A20/DCMI_D4)* 64(PE5/TRACED2/FSMC_A21/TIM9_CH1/DCMI_D6)* 65(PE2/TRACECLK/FSMC_A23/ETH_MII_TXD3)* 66(PE3/TRACED0/FSMC_A19)* 67(PE0/TIM4_ETR/FSMC_NBL0/DCMI_D2)* 68(PE1/FSMC_NBL1/DCMI_D3)* 70(PB9/SPI2_NSS/I2S2_WS/TIM4_CH4/TIM11_CH1/OTG_FS_SDA/SDIO_D5/DCMI_D7/I2C1_SDA/CAN1_TX)* 71(BOOT0/VPP)* 72(VDD)* 78(PB3/JTDO/TRACESWO/SPI3_SCK/I2S3_CK/TIM2_CH2/SPI1_SCK)* 79(PD5/FSMC_NWE/USART2_TX)* 81(PD3/FSMC_CLK/USART2_CTS)* 82(PD4/FSMC_NOE/USART2_RTS)* 84(PD2/TIM3_ETR/UART5_RXSDIO_CMD/DCMI_D11)* 87(PC10/SPI3_SCK/I2S3_CK/UART4_TX/SDIO_D2/DCMI_D8/USART3_TX)* 89(PA14/JTCK_SWCLK)* 91(PA10/USART1_RX/TIM1_CH3/OTG_FS_ID/DCMI_D1)* 92(PA13/JTMS_SWDIO)* 93(PA8/MCO1/USART1_CK/TIM1_CH1/I2C3_SCL/OTG_FS_SOF)* 94(PA9/USART1_TX/TIM1_CH2/I2C3_SMBA/DCMI_D0/OTG_FS_VBUS)* 97(PC6/I2S2_MCK/TIM8_CH1/SDIO_D6/USART6_TX/DCMI_D0/TIM3_CH1)* 98(PC7/I2S3_MCK/TIM8_CH2/SDIO_D7/USART6_RX_DCMI_D1/TIM3_CH2)*; PRO_Ucan 5(VREF)*

### Notes on the sheet
- Leds
- (near PRO_Derror) Red
- Propulsion
- (near PRO_DSelftest) Green
- Moteurs
- Capteurs DTx / TOR / ...
- (near PRO_codGauche) Codeurs
- Courant moteur (RFU)
- (near PRO_gyro) Gyro (RFU)
- (near PRO_UART2) UART2 (RFU)
- WHO AM I
- (near PRO_RupWAmI) Soudée si Gros Robot
- (near PRO_RdwnWAmI) Soudée si Petit Robot
- UART1
- CAN
- Title
- Size:
- Date:
- File:
- A2
- Number:
- Time:
- Revision:
- Sheet
- of

### Library data of the parts
PRO_CcodDA PRO_CcodDB PRO_CcodGA PRO_CcodGB PRO_CdCan1 PRO_CdCan2 PRO_CdDtc1-PRO_CdDtc4 PRO_CdDtd6 PRO_CdDtd7 PRO_CdGyro PRO_CfDTc1-PRO_CfDTc4 PRO_CfDTd6 PRO_CfDTd7 PRO_Cu1rx = Condensateur: Capacitor; Published: 8-Jun-2000; LatestRevisionDate: 17-Jul-2002; LatestRevisionNote: Re-released for DXP Platform.; PackageReference: RAD-0.3; Publisher: Altium Limited
PRO_codDroite PRO_codGauche PRO_Motors PRO_UART1 = RJ11_6/6: Right Angle, Standard Profile, Offset Latch DECconnect, Flangeless PCB Jack; Ports: 1; Positions/Loaded: Port1 - 6 Offset Latch/6; PerformanceCategory: 3; PCB_Mounting: Thru-Hole; DrillSize: Nominal, Rounded to nearest 0.05mm; PCB_Layout: Complies with Manufacturer's Recommendation.; Published: 25-Jun-2002; DatasheetDocument: 18-Dec-2001; PackageDocument: 18-Dec-2001; PackageReference: 15-43-6110; Publisher: Altium Limited; ComponentLink1Description: Manufacturer Link; ComponentLink1URL: http://www.molex.com/; ComponentLink2Description: Datasheet; ComponentLink2URL: http://www.molex.com/cmc_upload/common_files/1212003_41369catalogpage.pdf
  PRO_Motors PRO_UART1: Type: RJ11_6/6
PRO_currentMot PRO_UART2 = BARRETTE3: Header, 3-Pin; LatestRevisionDate: 17-Jul-2002; LatestRevisionNote: Re-released for DXP Platform.; Publisher: Altium Limited
PRO_Derror PRO_DSelftest = LED: Typical LED; Published: 8-Jun-2000; LatestRevisionDate: 08-Jul-2005; LatestRevisionNote: Mech Layer 1 removed.; PackageReference: LED-1; Publisher: Altium Limited
PRO_DTc1-PRO_DTc4 PRO_DTd6 PRO_DTd7 = BORNIER_3V_3.5MM
PRO_RCodDA PRO_RCodDB PRO_RCodGA PRO_RCodGB PRO_Rderror PRO_Rdselftest PRO_Rdtc1-PRO_Rdtc4 PRO_Rdtd6 PRO_Rdtd7 PRO_RdwnWAmI PRO_RfDTc1-PRO_RfDTc4 PRO_RfDTd6 PRO_RfDTd7 PRO_RpuDTc1-PRO_RpuDTc4 PRO_RpuDTd6 PRO_RpuDTd7 PRO_RpuU1rx PRO_RpuU1tx PRO_Rsu1rx PRO_RsU1tx PRO_RupWAmI = Resistor: Published: 8-Jun-2000; LatestRevisionDate: 17-Jul-2002; LatestRevisionNote: Re-released for DXP Platform.; PackageReference: AXIAL-0.5; Publisher: Altium Limited
PRO_STM32F4DISCOVERY = STM32F4DISCOVERY: KIT DE DEVELOPPEMENT POUR MICROCONTROLEUR STM32F407VGT6
PRO_Ucan = MCP2551-I/SN: High-Speed CAN Transceiver, 8-Pin SOIC, Industrial Temperature; Published: 25/11/09; DatasheetVersion: revE, Jan-2007; PackageVersion: revAW, Oct-2008; PackageReference: SOIC-SN8; Publisher: Damien Guitton; PackageDescription: 8-Lead Plastic Small Outline (SN) - Narrow, 3.90mm Body [SOIC]; Code_JEDEC: MS-012; Code_IPC: SOIC127P600-8; ComponentLink1Description: Manufacturer Link; ComponentLink1URL: http://www.microchip.com; ComponentLink2Description: Datasheet; ComponentLink2URL: http://ww1.microchip.com/downloads/en/DeviceDoc/21667E.pdf; ComponentLink3Description: Packaging Specification; ComponentLink3URL: http://ww1.microchip.com/downloads/en/PackagingSpec/00049AW.pdf
RFU = BARRETTE6: Header, 6-Pin; LatestRevisionDate: 17-Jul-2002; LatestRevisionNote: Re-released for DXP Platform.; Publisher: Altium Limited

## Sheet 2015_FDP_STRATEGIE.SchDoc
size A2
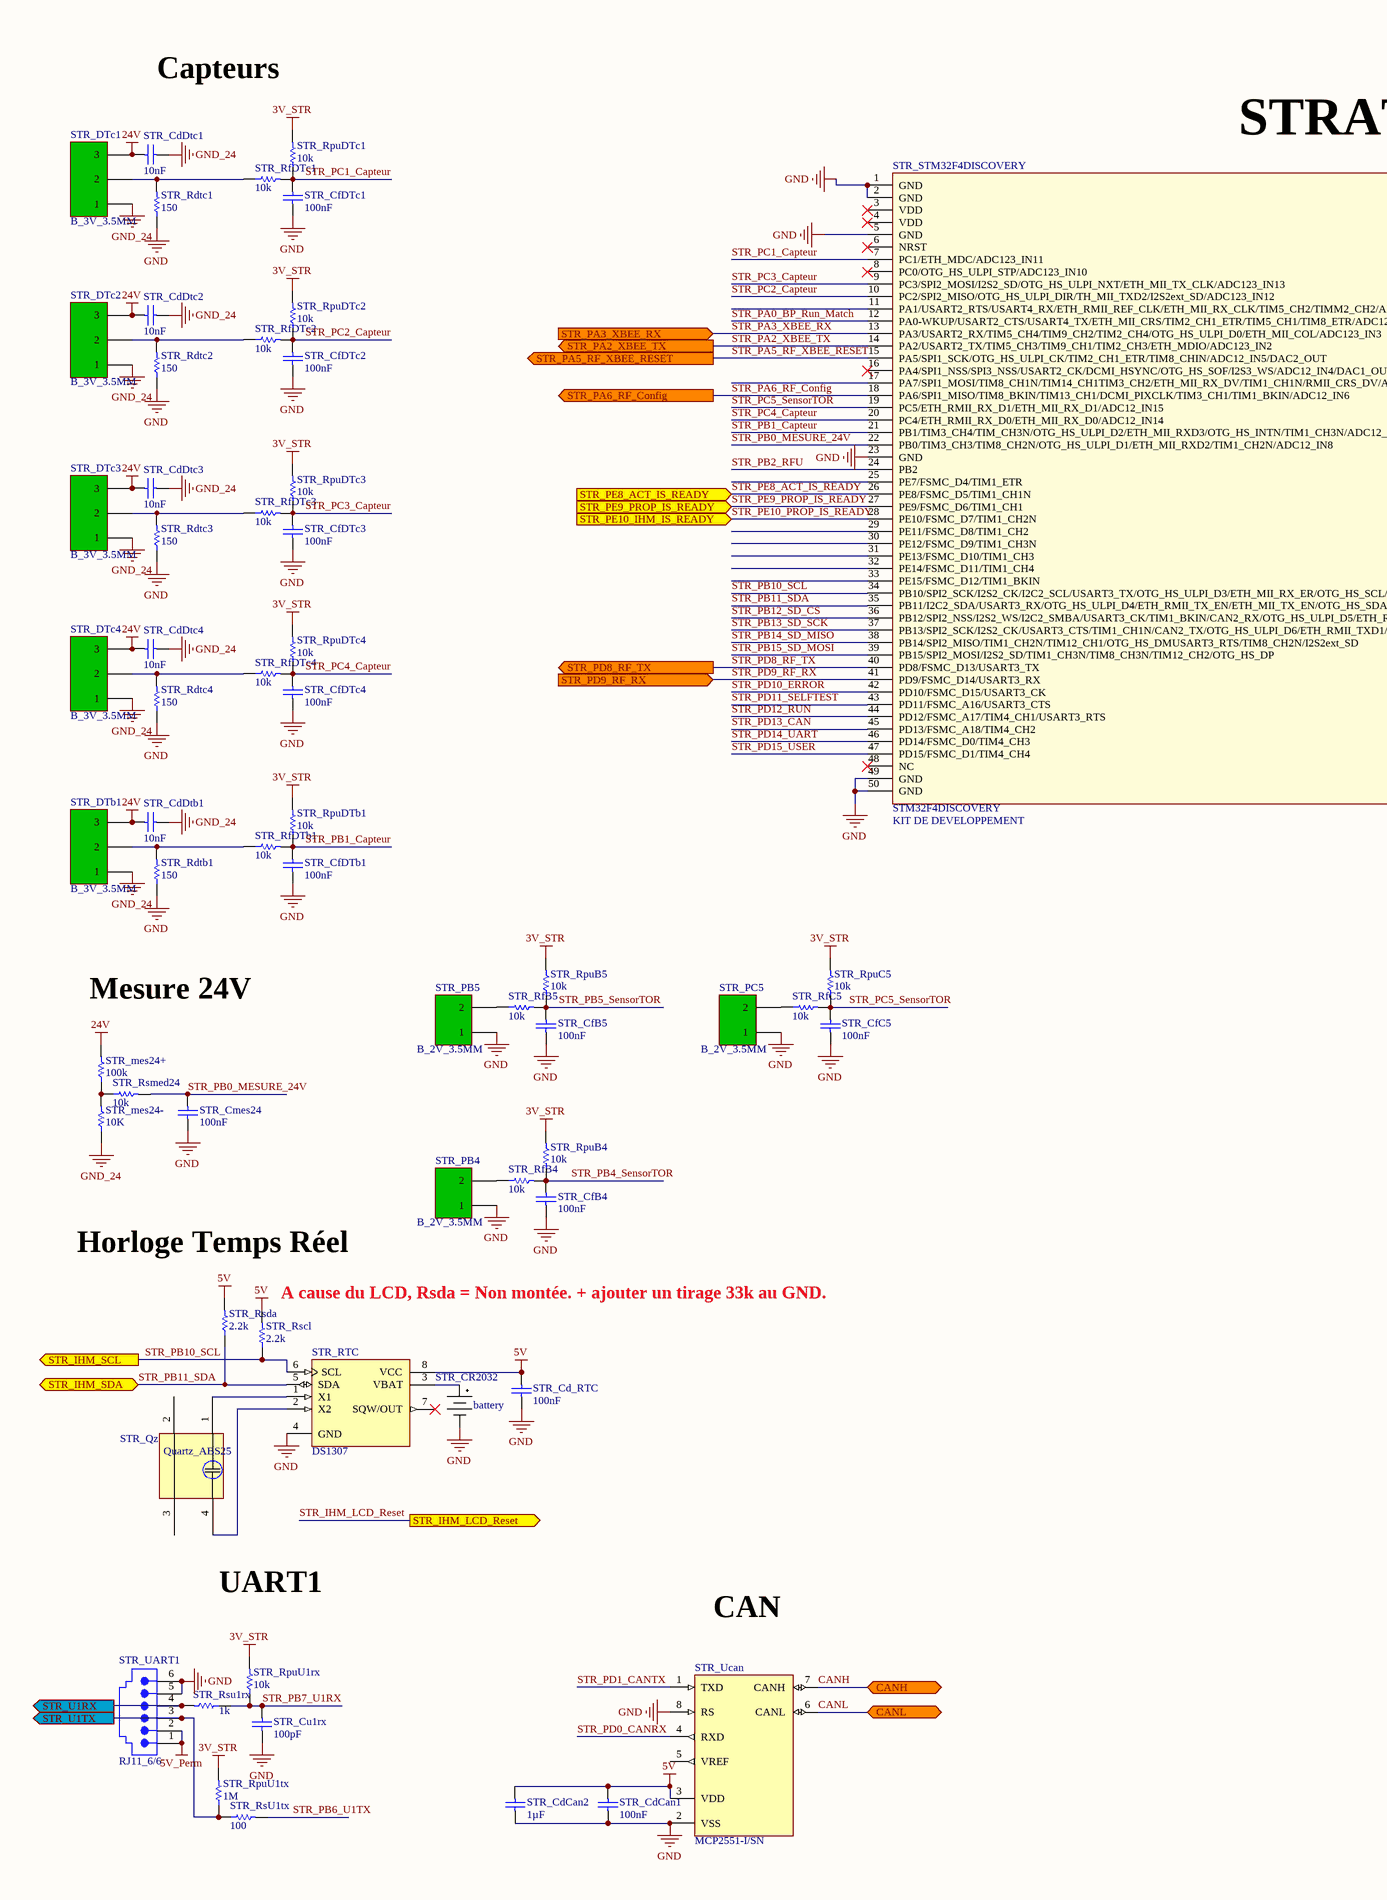
[diagram p3: 2015_FDP_STRATEGIE.SchDoc, left]
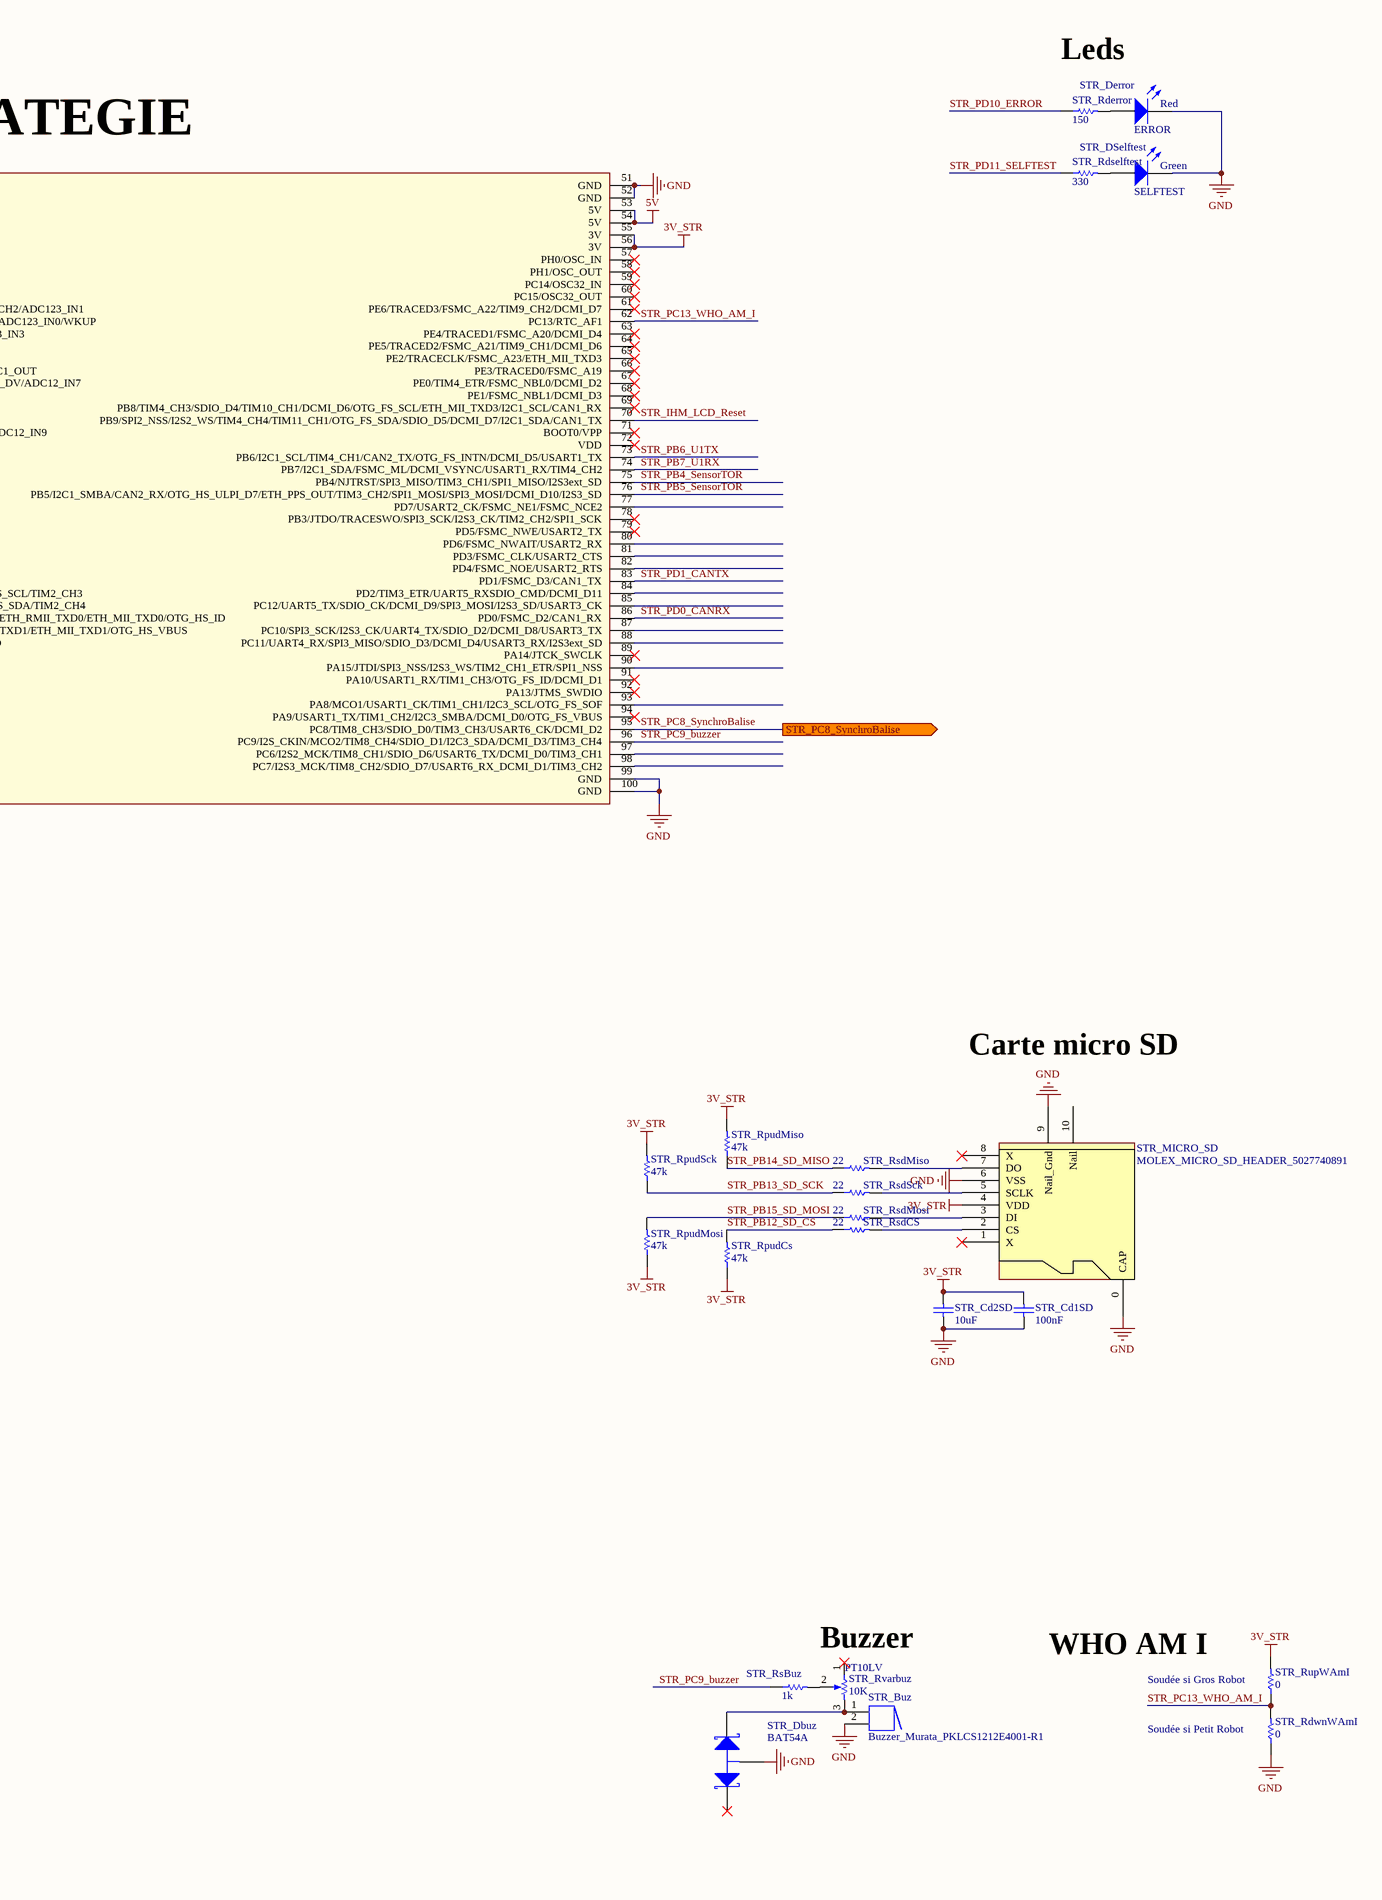
[diagram p4: 2015_FDP_STRATEGIE.SchDoc, right]

### Parts
STR_Buz  Buzzer_Murata_PKLCS1212E4001-R1  [Buzzer_Murata PKLCS1212]
STR_Cd1SD  100nF  [C0805_N]
STR_Cd2SD  10uF  [C1206_N]
STR_Cd_RTC  100nF  [C0805_N]
STR_CdCan1  100nF  [C0805_N]
STR_CdCan2  1µF  [C0805_N]
STR_CdDtb1  10nF  [C0805_N]
STR_CdDtc1  10nF  [C0805_N]
STR_CdDtc2  10nF  [C0805_N]
STR_CdDtc3  10nF  [C0805_N]
STR_CdDtc4  10nF  [C0805_N]
STR_CfB4  100nF  [C0805_N]
STR_CfB5  100nF  [C0805_N]
STR_CfC5  100nF  [C0805_N]
STR_CfDTb1  100nF  [C0805_N]
STR_CfDTc1  100nF  [C0805_N]
STR_CfDTc2  100nF  [C0805_N]
STR_CfDTc3  100nF  [C0805_N]
STR_CfDTc4  100nF  [C0805_N]
STR_Cmes24  100nF  [C0805_N]
STR_CR2032  battery  [Pile_boutton]
STR_Cu1rx  100pF  [C0805_N]
STR_Dbuz  BAT54A  [SOT23-3N]
STR_Derror  ERROR  [LED_0805]
STR_DSelftest  SELFTEST  [LED_0805]
STR_DTb1  B_3V_3.5MM  [BORNIER_3V_3.5MM]
STR_DTc1  B_3V_3.5MM  [BORNIER_3V_3.5MM]
STR_DTc2  B_3V_3.5MM  [BORNIER_3V_3.5MM]
STR_DTc3  B_3V_3.5MM  [BORNIER_3V_3.5MM]
STR_DTc4  B_3V_3.5MM  [BORNIER_3V_3.5MM]
STR_mes24+  100k  [R1206_N]
STR_mes24-  10K  [R1206_N]
STR_MICRO_SD  MOLEX_MICRO_SD_HEADER_5027740891  [MOLEX_MICRO_SD_HEADER_5027740891]
STR_PB4  B_2V_3.5MM  [BORNIER_2V_3.5MM]
STR_PB5  B_2V_3.5MM  [BORNIER_2V_3.5MM]
STR_PC5  B_2V_3.5MM  [BORNIER_2V_3.5MM]
STR_Qz  Quartz_ABS25  [Quartz_ABS25]
STR_Rderror  150  [R1206_N]
STR_Rdselftest  330  [R1206_N]
STR_Rdtb1  150  [R1206_N]
STR_Rdtc1  150  [R1206_N]
STR_Rdtc2  150  [R1206_N]
STR_Rdtc3  150  [R1206_N]
STR_Rdtc4  150  [R1206_N]
STR_RdwnWAmI  0  [R1206_N]
STR_RfB4  10k  [R1206_N]
STR_RfB5  10k  [R1206_N]
STR_RfC5  10k  [R1206_N]
STR_RfDTb1  10k  [R1206_N]
STR_RfDTc1  10k  [R1206_N]
STR_RfDTc2  10k  [R1206_N]
STR_RfDTc3  10k  [R1206_N]
STR_RfDTc4  10k  [R1206_N]
STR_RpuB4  10k  [R1206_N]
STR_RpuB5  10k  [R1206_N]
STR_RpuC5  10k  [R1206_N]
STR_RpudCs  47k  [R1206_N]
STR_RpudMiso  47k  [R1206_N]
STR_RpudMosi  47k  [R1206_N]
STR_RpudSck  47k  [R1206_N]
STR_RpuDTb1  10k  [R1206_N]
STR_RpuDTc1  10k  [R1206_N]
STR_RpuDTc2  10k  [R1206_N]
STR_RpuDTc3  10k  [R1206_N]
STR_RpuDTc4  10k  [R1206_N]
STR_RpuU1rx  10k  [R1206_N]
STR_RpuU1tx  1M  [R1206_N]
STR_RsBuz  1k  [R1206_N]
STR_Rscl  2.2k  [R1206_N]
STR_Rsda  2.2k  [R1206_N]
STR_RsdCS  22  [R1206_N]
STR_RsdMiso  22  [R1206_N]
STR_RsdMosi  22  [R1206_N]
STR_RsdSck  22  [R1206_N]
STR_Rsmed24  10k  [R1206_N]
STR_Rsu1rx  1k  [R1206_N]
STR_RsU1tx  100  [R1206_N]
STR_RTC  DS1307  [SO8_N]
STR_RupWAmI  0  [R1206_N]
STR_Rvarbuz  value 10K  Type: PT10LV  [TRIMMER_MONOTOUR_PT10LV]  (hidden comment: RESISTANCE_VARIABLE_TRAVERSANTE : PT10LV)
STR_STM32F4DISCOVERY  STM32F4DISCOVERY  Type: KIT DE DEVELOPPEMENT  [STM32_F4DISCOVERY]
STR_UART1  RJ11_6/6  [RJ11_6/6 - droit]
STR_Ucan  MCP2551-I/SN  [SO8_N]

### Ports
CANH (bidir), CANL (bidir), STR_IHM_LCD_Reset (out), STR_IHM_SCL (out), STR_IHM_SDA (bidir), STR_PA2_XBEE_TX (out), STR_PA3_XBEE_RX (in), STR_PA5_RF_XBEE_RESET (out), STR_PA6_RF_Config (out), STR_PC8_SynchroBalise (out), STR_PD8_RF_TX (out), STR_PD9_RF_RX (in), STR_PE8_ACT_IS_READY (in), STR_PE9_PROP_IS_READY (in), STR_PE10_IHM_IS_READY (in), STR_U1RX (out), STR_U1TX (out)

### Nets
3V_STR: STR_Cd1SD.2 STR_Cd2SD.2 STR_MICRO_SD.4(VDD) STR_RpuB4.2 STR_RpuB5.2 STR_RpuC5.2 STR_RpudCs.1 STR_RpudMiso.2 STR_RpudMosi.1 STR_RpudSck.2 STR_RpuDTb1.2 STR_RpuDTc1.2 STR_RpuDTc2.2 STR_RpuDTc3.2 STR_RpuDTc4.2 STR_RpuU1rx.2 STR_RpuU1tx.2 STR_RupWAmI.2 STR_STM32F4DISCOVERY.55(3V) STR_STM32F4DISCOVERY.56(3V)
5V: STR_Cd_RTC.1 STR_CdCan1.2 STR_CdCan2.2 STR_Rscl.2 STR_Rsda.2 STR_RTC.8(VCC) STR_STM32F4DISCOVERY.53(5V) STR_STM32F4DISCOVERY.54(5V) STR_Ucan.3(VDD)
5V_Perm: STR_UART1.1 STR_UART1.2
24V: STR_CdDtb1.2 STR_CdDtc1.2 STR_CdDtc2.2 STR_CdDtc3.2 STR_CdDtc4.2 STR_DTb1.3 STR_DTc1.3 STR_DTc2.3 STR_DTc3.3 STR_DTc4.3 STR_mes24+.2
GND: STR_Buz.2 STR_Cd1SD.1 STR_Cd2SD.1 STR_Cd_RTC.2 STR_CdCan1.1 STR_CdCan2.1 STR_CfB4.1 STR_CfB5.1 STR_CfC5.1 STR_CfDTb1.1 STR_CfDTc1.1 STR_CfDTc2.1 STR_CfDTc3.1 STR_CfDTc4.1 STR_Cmes24.1 STR_CR2032.2(-) STR_Cu1rx.1 STR_Dbuz.3(A) STR_Derror.2(K) STR_DSelftest.2(K) STR_MICRO_SD.0(CAP) STR_MICRO_SD.6(VSS) STR_MICRO_SD.9(Nail_Gnd) STR_PB4.1 STR_PB5.1 STR_PC5.1 STR_Rdtb1.1 STR_Rdtc1.1 STR_Rdtc2.1 STR_Rdtc3.1 STR_Rdtc4.1 STR_RdwnWAmI.1 STR_RTC.4(GND) STR_STM32F4DISCOVERY.1(GND) STR_STM32F4DISCOVERY.2(GND) STR_STM32F4DISCOVERY.5(GND) STR_STM32F4DISCOVERY.23(GND) STR_STM32F4DISCOVERY.49(GND) STR_STM32F4DISCOVERY.50(GND) STR_STM32F4DISCOVERY.51(GND) STR_STM32F4DISCOVERY.52(GND) STR_STM32F4DISCOVERY.99(GND) STR_STM32F4DISCOVERY.100(GND) STR_UART1.5 STR_UART1.6 STR_Ucan.2(VSS) STR_Ucan.8(RS)
GND_24: STR_CdDtb1.1 STR_CdDtc1.1 STR_CdDtc2.1 STR_CdDtc3.1 STR_CdDtc4.1 STR_DTb1.1 STR_DTc1.1 STR_DTc2.1 STR_DTc3.1 STR_DTc4.1 STR_mes24-.1
CANH: STR_Ucan.7(CANH) ; port CANH
CANL: STR_Ucan.6(CANL) ; port CANL
STR_IHM_LCD_Reset: STR_STM32F4DISCOVERY.70(PB9/SPI2_NSS/I2S2_WS/TIM4_CH4/TIM11_CH1/OTG_FS_SDA/SDIO_D5/DCMI_D7/I2C1_SDA/CAN1_TX) ; port STR_IHM_LCD_Reset
STR_PA0_BP_Run_Match: STR_STM32F4DISCOVERY.12(PA0-WKUP/USART2_CTS/USART4_TX/ETH_MII_CRS/TIM2_CH1_ETR/TIM5_CH1/TIM8_ETR/ADC123_IN0/WKUP)
STR_PA2_XBEE_TX: STR_STM32F4DISCOVERY.14(PA2/USART2_TX/TIM5_CH3/TIM9_CH1/TIM2_CH3/ETH_MDIO/ADC123_IN2) ; port STR_PA2_XBEE_TX
STR_PA3_XBEE_RX: STR_STM32F4DISCOVERY.13(PA3/USART2_RX/TIM5_CH4/TIM9_CH2/TIM2_CH4/OTG_HS_ULPI_D0/ETH_MII_COL/ADC123_IN3) ; port STR_PA3_XBEE_RX
STR_PA5_RF_XBEE_RESET: STR_STM32F4DISCOVERY.15(PA5/SPI1_SCK/OTG_HS_ULPI_CK/TIM2_CH1_ETR/TIM8_CHIN/ADC12_IN5/DAC2_OUT) ; port STR_PA5_RF_XBEE_RESET
STR_PA6_RF_Config: STR_STM32F4DISCOVERY.18(PA6/SPI1_MISO/TIM8_BKIN/TIM13_CH1/DCMI_PIXCLK/TIM3_CH1/TIM1_BKIN/ADC12_IN6) ; port STR_PA6_RF_Config
STR_PB0_MESURE_24V: STR_Cmes24.2 STR_Rsmed24.2 STR_STM32F4DISCOVERY.22(PB0/TIM3_CH3/TIM8_CH2N/OTG_HS_ULPI_D1/ETH_MII_RXD2/TIM1_CH2N/ADC12_IN8)
STR_PB1_Capteur: STR_CfDTb1.2 STR_RfDTb1.2 STR_RpuDTb1.1 STR_STM32F4DISCOVERY.21(PB1/TIM3_CH4/TIM_CH3N/OTG_HS_ULPI_D2/ETH_MII_RXD3/OTG_HS_INTN/TIM1_CH3N/ADC12_IN9)
STR_PB2_RFU: STR_STM32F4DISCOVERY.24(PB2)
STR_PB4_SensorTOR: STR_CfB4.2 STR_RfB4.2 STR_RpuB4.1 STR_STM32F4DISCOVERY.75(PB4/NJTRST/SPI3_MISO/TIM3_CH1/SPI1_MISO/I2S3ext_SD)
STR_PB5_SensorTOR: STR_CfB5.2 STR_RfB5.2 STR_RpuB5.1 STR_STM32F4DISCOVERY.76(PB5/I2C1_SMBA/CAN2_RX/OTG_HS_ULPI_D7/ETH_PPS_OUT/TIM3_CH2/SPI1_MOSI/SPI3_MOSI/DCMI_D10/I2S3_SD)
STR_PB6_U1TX: STR_RsU1tx.2 STR_STM32F4DISCOVERY.73(PB6/I2C1_SCL/TIM4_CH1/CAN2_TX/OTG_FS_INTN/DCMI_D5/USART1_TX)
STR_PB7_U1RX: STR_Cu1rx.2 STR_RpuU1rx.1 STR_Rsu1rx.1 STR_STM32F4DISCOVERY.74(PB7/I2C1_SDA/FSMC_ML/DCMI_VSYNC/USART1_RX/TIM4_CH2)
STR_PB10_SCL: STR_Rscl.1 STR_RTC.6(SCL) STR_STM32F4DISCOVERY.34(PB10/SPI2_SCK/I2S2_CK/I2C2_SCL/USART3_TX/OTG_HS_ULPI_D3/ETH_MII_RX_ER/OTG_HS_SCL/TIM2_CH3) ; port STR_IHM_SCL  [project net STR_IHM_SCL]
STR_PB11_SDA: STR_Rsda.1 STR_RTC.5(SDA) STR_STM32F4DISCOVERY.35(PB11/I2C2_SDA/USART3_RX/OTG_HS_ULPI_D4/ETH_RMII_TX_EN/ETH_MII_TX_EN/OTG_HS_SDA/TIM2_CH4) ; port STR_IHM_SDA  [project net STR_IHM_SDA]
STR_PB12_SD_CS: STR_RpudCs.2 STR_RsdCS.1 STR_STM32F4DISCOVERY.36(PB12/SPI2_NSS/I2S2_WS/I2C2_SMBA/USART3_CK/TIM1_BKIN/CAN2_RX/OTG_HS_ULPI_D5/ETH_RMII_TXD0/ETH_MII_TXD0/OTG_HS_ID)
STR_PB13_SD_SCK: STR_RpudSck.1 STR_RsdSck.1 STR_STM32F4DISCOVERY.37(PB13/SPI2_SCK/I2S2_CK/USART3_CTS/TIM1_CH1N/CAN2_TX/OTG_HS_ULPI_D6/ETH_RMII_TXD1/ETH_MII_TXD1/OTG_HS_VBUS)
STR_PB14_SD_MISO: STR_RpudMiso.1 STR_RsdMiso.1 STR_STM32F4DISCOVERY.38(PB14/SPI2_MISO/TIM1_CH2N/TIM12_CH1/OTG_HS_DMUSART3_RTS/TIM8_CH2N/I2S2ext_SD)
STR_PB15_SD_MOSI: STR_RpudMosi.2 STR_RsdMosi.1 STR_STM32F4DISCOVERY.39(PB15/SPI2_MOSI/I2S2_SD/TIM1_CH3N/TIM8_CH3N/TIM12_CH2/OTG_HS_DP)
STR_PC1_Capteur: STR_CfDTc1.2 STR_RfDTc1.2 STR_RpuDTc1.1 STR_STM32F4DISCOVERY.7(PC1/ETH_MDC/ADC123_IN11)
STR_PC2_Capteur: STR_CfDTc2.2 STR_RfDTc2.2 STR_RpuDTc2.1 STR_STM32F4DISCOVERY.10(PC2/SPI2_MISO/OTG_HS_ULPI_DIR/TH_MII_TXD2/I2S2ext_SD/ADC123_IN12)
STR_PC3_Capteur: STR_CfDTc3.2 STR_RfDTc3.2 STR_RpuDTc3.1 STR_STM32F4DISCOVERY.9(PC3/SPI2_MOSI/I2S2_SD/OTG_HS_ULPI_NXT/ETH_MII_TX_CLK/ADC123_IN13)
STR_PC4_Capteur: STR_CfDTc4.2 STR_RfDTc4.2 STR_RpuDTc4.1 STR_STM32F4DISCOVERY.20(PC4/ETH_RMII_RX_D0/ETH_MII_RX_D0/ADC12_IN14)
STR_PC5_SensorTOR: STR_CfC5.2 STR_RfC5.2 STR_RpuC5.1 STR_STM32F4DISCOVERY.19(PC5/ETH_RMII_RX_D1/ETH_MII_RX_D1/ADC12_IN15)
STR_PC8_SynchroBalise: STR_STM32F4DISCOVERY.95(PC8/TIM8_CH3/SDIO_D0/TIM3_CH3/USART6_CK/DCMI_D2) ; port STR_PC8_SynchroBalise
STR_PC9_buzzer: STR_RsBuz.1 STR_STM32F4DISCOVERY.96(PC9/I2S_CKIN/MCO2/TIM8_CH4/SDIO_D1/I2C3_SDA/DCMI_D3/TIM3_CH4)
STR_PC13_WHO_AM_I: STR_RdwnWAmI.2 STR_RupWAmI.1 STR_STM32F4DISCOVERY.62(PC13/RTC_AF1)
STR_PD0_CANRX: STR_STM32F4DISCOVERY.86(PD0/FSMC_D2/CAN1_RX) STR_Ucan.4(RXD)
STR_PD1_CANTX: STR_STM32F4DISCOVERY.83(PD1/FSMC_D3/CAN1_TX) STR_Ucan.1(TXD)
STR_PD8_RF_TX: STR_STM32F4DISCOVERY.40(PD8/FSMC_D13/USART3_TX) ; port STR_PD8_RF_TX
STR_PD9_RF_RX: STR_STM32F4DISCOVERY.41(PD9/FSMC_D14/USART3_RX) ; port STR_PD9_RF_RX
STR_PD10_ERROR: STR_Rderror.1 STR_STM32F4DISCOVERY.42(PD10/FSMC_D15/USART3_CK)
STR_PD11_SELFTEST: STR_Rdselftest.1 STR_STM32F4DISCOVERY.43(PD11/FSMC_A16/USART3_CTS)
STR_PD12_RUN: STR_STM32F4DISCOVERY.44(PD12/FSMC_A17/TIM4_CH1/USART3_RTS)
STR_PD13_CAN: STR_STM32F4DISCOVERY.45(PD13/FSMC_A18/TIM4_CH2)
STR_PD14_UART: STR_STM32F4DISCOVERY.46(PD14/FSMC_D0/TIM4_CH3)
STR_PD15_USER: STR_STM32F4DISCOVERY.47(PD15/FSMC_D1/TIM4_CH4)
STR_PE8_ACT_IS_READY: STR_STM32F4DISCOVERY.26(PE8/FSMC_D5/TIM1_CH1N) ; port STR_PE8_ACT_IS_READY
STR_PE9_PROP_IS_READY: STR_STM32F4DISCOVERY.27(PE9/FSMC_D6/TIM1_CH1) ; port STR_PE9_PROP_IS_READY
STR_PE10_PROP_IS_READY: STR_STM32F4DISCOVERY.28(PE10/FSMC_D7/TIM1_CH2N) ; port STR_PE10_IHM_IS_READY
STR_U1RX: STR_Rsu1rx.2 STR_UART1.4 ; port STR_U1RX
STR_U1TX: STR_RpuU1tx.1 STR_RsU1tx.1 STR_UART1.3 ; port STR_U1TX
NetSTR_Buz_1: STR_Buz.1 STR_Dbuz.1(K1) STR_Rvarbuz.3
NetSTR_CR2032_1: STR_CR2032.1(+) STR_RTC.3(VBAT)
NetSTR_Derror_1: STR_Derror.1(A) STR_Rderror.2
NetSTR_DSelftest_1: STR_DSelftest.1(A) STR_Rdselftest.2
NetSTR_DTb1_2: STR_DTb1.2 STR_Rdtb1.2 STR_RfDTb1.1
NetSTR_DTc1_2: STR_DTc1.2 STR_Rdtc1.2 STR_RfDTc1.1
NetSTR_DTc2_2: STR_DTc2.2 STR_Rdtc2.2 STR_RfDTc2.1
NetSTR_DTc3_2: STR_DTc3.2 STR_Rdtc3.2 STR_RfDTc3.1
NetSTR_DTc4_2: STR_DTc4.2 STR_Rdtc4.2 STR_RfDTc4.1
NetSTR_mes24+_1: STR_mes24+.1 STR_mes24-.2 STR_Rsmed24.1
NetSTR_MICRO_SD_2: STR_MICRO_SD.2(CS) STR_RsdCS.2
NetSTR_MICRO_SD_3: STR_MICRO_SD.3(DI) STR_RsdMosi.2
NetSTR_MICRO_SD_5: STR_MICRO_SD.5(SCLK) STR_RsdSck.2
NetSTR_MICRO_SD_7: STR_MICRO_SD.7(DO) STR_RsdMiso.2
NetSTR_PB4_2: STR_PB4.2 STR_RfB4.1
NetSTR_PB5_2: STR_PB5.2 STR_RfB5.1
NetSTR_PC5_2: STR_PC5.2 STR_RfC5.1
NetSTR_Qz_1: STR_Qz.1 STR_RTC.1(X1)
NetSTR_Qz_4: STR_Qz.4 STR_RTC.2(X2)
NetSTR_RsBuz_2: STR_RsBuz.2 STR_Rvarbuz.2

Not connected (* = marked no-connect by the designer): STR_Dbuz 2(K2)*; STR_MICRO_SD 1(X)* 8(X)* 10(Nail); STR_Qz 2 3; STR_RTC 7(SQW/OUT)*; STR_Rvarbuz 1*; STR_STM32F4DISCOVERY 3(VDD)* 4(VDD)* 6(NRST)* 8(PC0/OTG_HS_ULPI_STP/ADC123_IN10)* 11(PA1/USART2_RTS/USART4_RX/ETH_RMII_REF_CLK/ETH_MII_RX_CLK/TIM5_CH2/TIMM2_CH2/ADC123_IN1) 16(PA4/SPI1_NSS/SPI3_NSS/USART2_CK/DCMI_HSYNC/OTG_HS_SOF/I2S3_WS/ADC12_IN4/DAC1_OUT)* 17(PA7/SPI1_MOSI/TIM8_CH1N/TIM14_CH1TIM3_CH2/ETH_MII_RX_DV/TIM1_CH1N/RMII_CRS_DV/ADC12_IN7) 25(PE7/FSMC_D4/TIM1_ETR) 29(PE11/FSMC_D8/TIM1_CH2) 30(PE12/FSMC_D9/TIM1_CH3N) 31(PE13/FSMC_D10/TIM1_CH3) 32(PE14/FSMC_D11/TIM1_CH4) 33(PE15/FSMC_D12/TIM1_BKIN) 48(NC)* 57(PH0/OSC_IN)* 58(PH1/OSC_OUT)* 59(PC14/OSC32_IN)* 60(PC15/OSC32_OUT)* 61(PE6/TRACED3/FSMC_A22/TIM9_CH2/DCMI_D7)* 63(PE4/TRACED1/FSMC_A20/DCMI_D4)* 64(PE5/TRACED2/FSMC_A21/TIM9_CH1/DCMI_D6)* 65(PE2/TRACECLK/FSMC_A23/ETH_MII_TXD3)* 66(PE3/TRACED0/FSMC_A19)* 67(PE0/TIM4_ETR/FSMC_NBL0/DCMI_D2)* 68(PE1/FSMC_NBL1/DCMI_D3)* 69(PB8/TIM4_CH3/SDIO_D4/TIM10_CH1/DCMI_D6/OTG_FS_SCL/ETH_MII_TXD3/I2C1_SCL/CAN1_RX)* 71(BOOT0/VPP)* 72(VDD)* 77(PD7/USART2_CK/FSMC_NE1/FSMC_NCE2) 78(PB3/JTDO/TRACESWO/SPI3_SCK/I2S3_CK/TIM2_CH2/SPI1_SCK)* 79(PD5/FSMC_NWE/USART2_TX)* 80(PD6/FSMC_NWAIT/USART2_RX) 81(PD3/FSMC_CLK/USART2_CTS) 82(PD4/FSMC_NOE/USART2_RTS) 84(PD2/TIM3_ETR/UART5_RXSDIO_CMD/DCMI_D11) 85(PC12/UART5_TX/SDIO_CK/DCMI_D9/SPI3_MOSI/I2S3_SD/USART3_CK) 87(PC10/SPI3_SCK/I2S3_CK/UART4_TX/SDIO_D2/DCMI_D8/USART3_TX) 88(PC11/UART4_RX/SPI3_MISO/SDIO_D3/DCMI_D4/USART3_RX/I2S3ext_SD) 89(PA14/JTCK_SWCLK)* 90(PA15/JTDI/SPI3_NSS/I2S3_WS/TIM2_CH1_ETR/SPI1_NSS) 91(PA10/USART1_RX/TIM1_CH3/OTG_FS_ID/DCMI_D1)* 92(PA13/JTMS_SWDIO)* 93(PA8/MCO1/USART1_CK/TIM1_CH1/I2C3_SCL/OTG_FS_SOF) 94(PA9/USART1_TX/TIM1_CH2/I2C3_SMBA/DCMI_D0/OTG_FS_VBUS)* 97(PC6/I2S2_MCK/TIM8_CH1/SDIO_D6/USART6_TX/DCMI_D0/TIM3_CH1) 98(PC7/I2S3_MCK/TIM8_CH2/SDIO_D7/USART6_RX_DCMI_D1/TIM3_CH2); STR_Ucan 5(VREF)

### Notes on the sheet
- Capteurs
- Leds
- (near STR_Derror) Red
- (near STR_STM32F4DISCOVERY) STRATEGIE
- (near STR_DSelftest) Green
- Mesure 24V
- Carte micro SD
- Horloge Temps Réel
- (near STR_Rscl) A cause du LCD, Rsda = Non montée. + ajouter un tirage 33k au GND.
- UART1
- CAN
- (near STR_Rvarbuz) Buzzer
- WHO AM I
- (near STR_RupWAmI) Soudée si Gros Robot
- (near STR_RdwnWAmI) Soudée si Petit Robot
- Title
- Size:
- Date:
- File:
- A2
- Number:
- Time:
- Revision:
- Sheet
- of

### Library data of the parts
STR_Buz = Buzzer_Murata_PKLCS1212E4001-R1: Manufacturer Description: MURATA - PKLCS1212E4001-R1 - BUZZER CMS 4KHZ; Manufacturer: MURATA; Manufacturer Part Number: PKLCS1212E4001-R1; Supplier 1: Farnell; Supplier Part Number 1: 1192551; Supplier 2: Newark; Supplier Part Number 2: 01M8494; Supplier 3: Mouser; Supplier Part Number 3: 81-PKLCS1212E4001
STR_Cd1SD STR_Cd2SD STR_Cd_RTC STR_CdCan1 STR_CdCan2 STR_CdDtb1 STR_CdDtc1-STR_CdDtc4 STR_CfB4 STR_CfB5 STR_CfC5 STR_CfDTb1 STR_CfDTc1-STR_CfDTc4 STR_Cmes24 STR_Cu1rx = Condensateur: Capacitor; Published: 8-Jun-2000; LatestRevisionDate: 17-Jul-2002; LatestRevisionNote: Re-released for DXP Platform.; PackageReference: RAD-0.3; Publisher: Altium Limited
STR_CR2032 = battery: Battery, Pile; Tech: CMOS; Eco Plan: RoHS Compliant; ComponentLink0Description: PIN assignation for the battery component; ComponentLink1Description: Manufacturer Link; ComponentLink2Description: Handbook; ComponentLink3Description: Packaging Specification; Created: 08-08-07; LatestRevisionDate: 08-08-07; LatestRevisionNote: creation; PackageDescription: 2-pins; PackageVersion: ver1.0, Aug-2007; Published: 03-07-07; Publisher: Jean-Philippe Oudet; Type: Alim
STR_Dbuz = Diode Shottky double  BAT54A: as D_BTtx on sheet 2015_FDP_SCHEMA; ComponentLink1URL: http://www.farnell.com/datasheets/27632.pdf; ComponentLink1Description: http://www.farnell.com/datasheets/27632.pdf; Supplier Part Number: 9526498; Supplier: Farnell; RoHS: YES; Manufacturer Part Number: BAT54A
STR_Derror STR_DSelftest = LED: Typical LED; Published: 8-Jun-2000; LatestRevisionDate: 08-Jul-2005; LatestRevisionNote: Mech Layer 1 removed.; PackageReference: LED-1; Publisher: Altium Limited
STR_DTb1 STR_DTc1-STR_DTc4 = BORNIER_3V_3.5MM
STR_mes24+ STR_mes24- STR_Rderror STR_Rdselftest STR_Rdtb1 STR_Rdtc1-STR_Rdtc4 STR_RdwnWAmI STR_RfB4 STR_RfB5 STR_RfC5 STR_RfDTb1 STR_RfDTc1-STR_RfDTc4 STR_RpuB4 STR_RpuB5 STR_RpuC5 STR_RpudCs STR_RpudMiso STR_RpudMosi STR_RpudSck STR_RpuDTb1 STR_RpuDTc1-STR_RpuDTc4 STR_RpuU1rx STR_RpuU1tx STR_RsBuz STR_Rscl STR_Rsda STR_RsdCS STR_RsdMiso STR_RsdMosi STR_RsdSck STR_Rsmed24 STR_Rsu1rx STR_RsU1tx STR_RupWAmI = Resistor: Published: 8-Jun-2000; LatestRevisionDate: 17-Jul-2002; LatestRevisionNote: Re-released for DXP Platform.; PackageReference: AXIAL-0.5; Publisher: Altium Limited
STR_PB4 STR_PB5 STR_PC5 = BORNIER_2V_3.5MM
STR_RTC = DS1307: 64 X 8 Serial Real-Time Clock; Published: 13-Oct-2000; LatestRevisionDate: 06-Jun-2005; LatestRevisionNote: Stylized 3D Model Added.; DatasheetVersion: 10-Aug-1999; PackageVersion: 1999; PackageReference: DIP8; Publisher: Altium Limited; PackageDescription: DIP; 8 Leads; Row Spacing 7.62 mm; Pitch 2.54 mm; ComponentLink1Description: Manufacturer Link; ComponentLink1URL: http://www.maxim-ic.com/; ComponentLink2Description: Datasheet; ComponentLink2URL: http://pdfserv.maxim-ic.com/en/ds/DS1307.pdf; ComponentLink3Description: Discontinuation Notice; ComponentLink3URL: http://www.maxim-ic.com/qa/pdfs/non-obsolescence-letter.pdf
STR_Rvarbuz = RESISTANCE_VARIABLE_TRAVERSANTE : PT10LV: RESISTANCE VARIABLE_TRAVERSANTE : PT10LV
STR_STM32F4DISCOVERY = STM32F4DISCOVERY: as PRO_STM32F4DISCOVERY on sheet 2015_FDP_PROPULSION
STR_UART1 = RJ11_6/6: as PRO_codDroite on sheet 2015_FDP_PROPULSION; Published: 25-Jun-2002; DatasheetDocument: 18-Dec-2001; PackageDocument: 18-Dec-2001; PackageReference: 15-43-6110; Publisher: Altium Limited; ComponentLink1Description: Manufacturer Link; ComponentLink1URL: http://www.molex.com/; ComponentLink2Description: Datasheet; ComponentLink2URL: http://www.molex.com/cmc_upload/common_files/1212003_41369catalogpage.pdf; Type: RJ11_6/6
STR_Ucan = MCP2551-I/SN: as PRO_Ucan on sheet 2015_FDP_PROPULSION; Published: 25/11/09; DatasheetVersion: revE, Jan-2007; PackageVersion: revAW, Oct-2008; PackageReference: SOIC-SN8; Publisher: Damien Guitton; PackageDescription: 8-Lead Plastic Small Outline (SN) - Narrow, 3.90mm Body [SOIC]; Code_JEDEC: MS-012; Code_IPC: SOIC127P600-8; ComponentLink1Description: Manufacturer Link; ComponentLink1URL: http://www.microchip.com; ComponentLink2Description: Datasheet; ComponentLink2URL: http://ww1.microchip.com/downloads/en/DeviceDoc/21667E.pdf; ComponentLink3Description: Packaging Specification; ComponentLink3URL: http://ww1.microchip.com/downloads/en/PackagingSpec/00049AW.pdf